# Altium project COMM_BOARD_V1.PrjPcb (part 1 of 2)
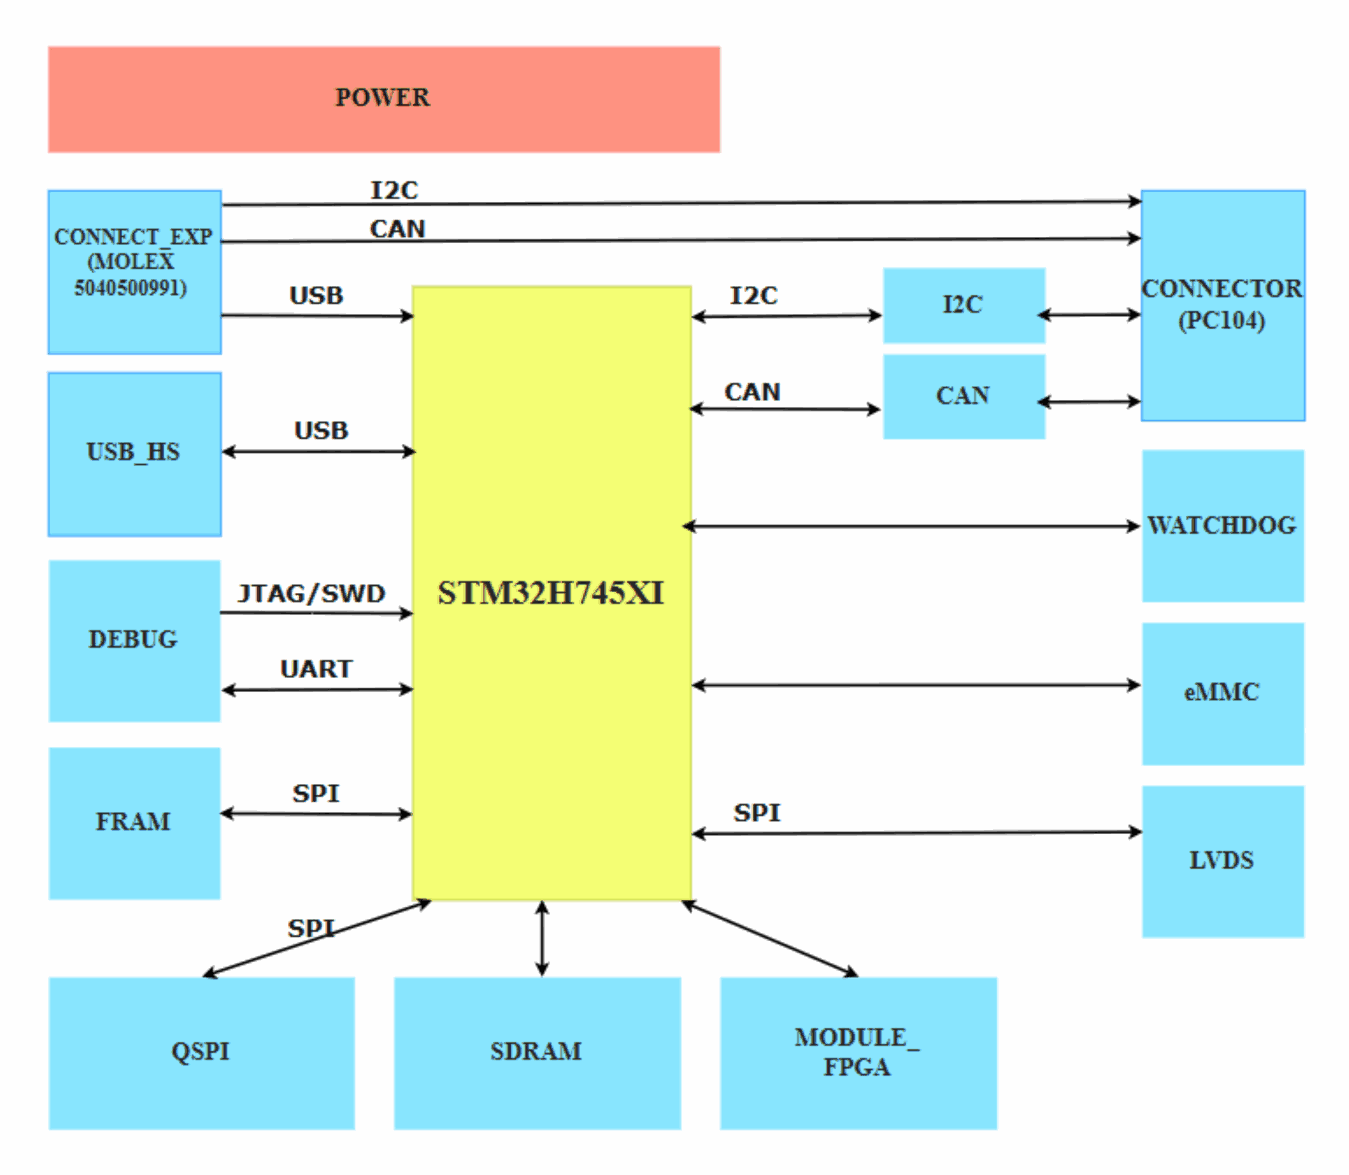
[diagram p0: BLOCK_DIAGRAM.SchDoc]
Board_Assembly_Revision: 04; Board_Document_Date: 27-Sep-2024; Board_Name: STM32H7xxx-Disco; Board_PCB_Revision: B; Board_Reference: MB1381
17 sheets, 345 parts. Net scope: flat (ports and power ports of the same name join across sheets).
Board files: PCB2.PcbDoc, PCB3.PcbDoc
Sheets:
  BLOCK_DIAGRAM.SchDoc
  POWER_TREE.SchDoc
  POWER.SchDoc
  MCU.SchDoc
  SDRAM.SchDoc
  MCU_POWER.SchDoc
  eMMC.SchDoc
  CAN.SchDoc
  USB_HS_DEVICE.SchDoc
  LVDS.SchDoc
  MODULE_FPGA.SchDoc
  DEBUG.SchDoc
  I2C.SchDoc
  CONNECTOR.SchDoc
  FRAM.SchDoc
  CONNECT_EXP.SchDoc
  WATCHDOG.SchDoc

## Sheet BLOCK_DIAGRAM.SchDoc
size 420 x 297 mm

### Notes on the sheet
- Sub-system:
- Design by:
- Sheet title:
- Project:
- Sheet:
- of
- Checked by:
- Approved by:
- Doc no:
- Revision:
- Size:
- Date:

## Sheet POWER_TREE.SchDoc
size 420 x 297 mm

### Notes on the sheet
- Sub-system:
- Design by:
- Sheet title:
- Project:
- Sheet:
- of
- Checked by:
- Approved by:
- Doc no:
- Revision:
- Size:
- Date:
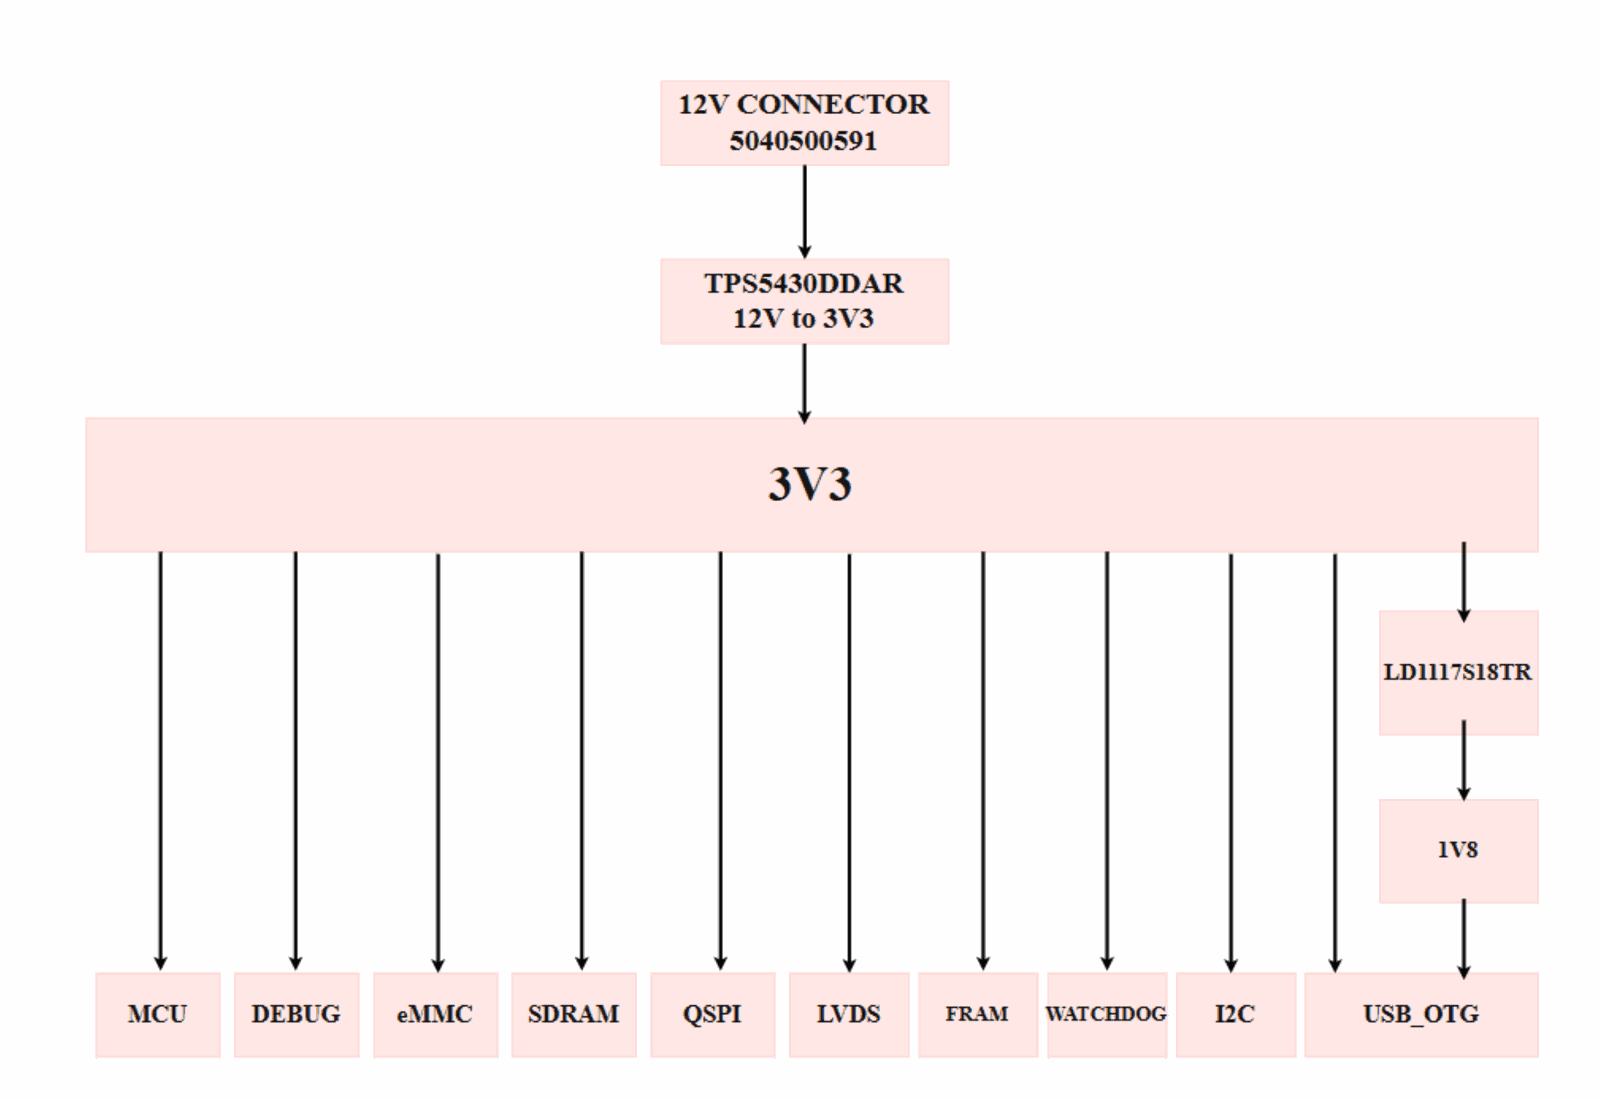
[diagram p1: POWER_TREE.SchDoc]

## Sheet POWER.SchDoc
size 420 x 297 mm; SheetNumber: 7; SheetTotal: 8
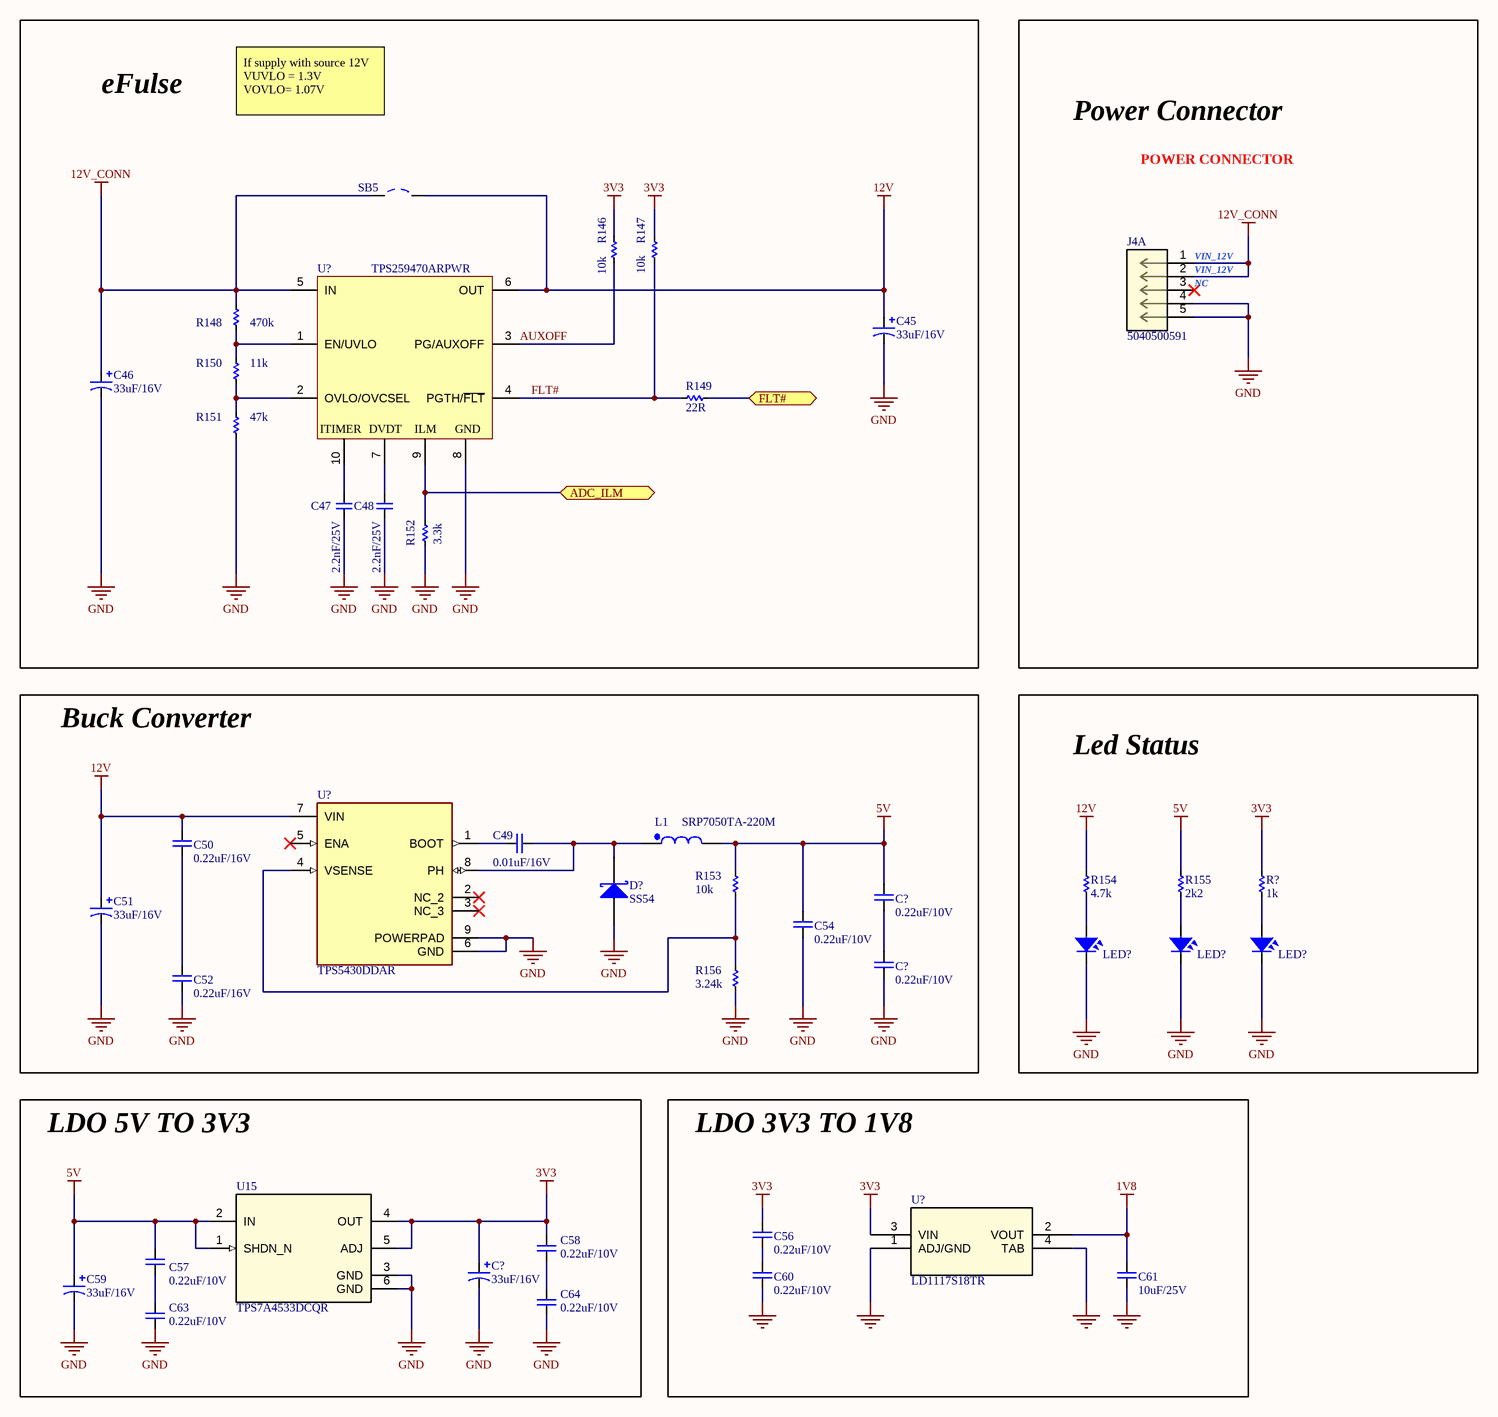
[diagram p2: POWER.SchDoc]

### Parts
(Parts that share a designator on the sheet are numbered #1, #2 ... from top to bottom, then left to right.)
C45  33uF/16V  [CAP_MP_1608X90]
C46  33uF/16V  [CAP_MP_1608X90]
C47  2.2nF/25V  [CAP_C_1608X80]
C48  2.2nF/25V  [CAP_C_1608X80]
C49  0.01uF/16V  [CAP_C_1608X80]
C50  0.22uF/16V  [CAP_C_1608X80_L]
C51  33uF/16V  [CAP_MP_1608X90]
C52  0.22uF/16V  [CAP_C_1608X80_L]
C54  0.22uF/10V  [CAP_C_1608X80]
C56  0.22uF/10V  [CAP_C_1608X80]
C57  0.22uF/10V  [CAP_C_1608X80]
C58  0.22uF/10V  [CAP_C_1608X80]
C59  33uF/16V  [CAP_MP_1608X90]
C60  0.22uF/10V  [CAP_C_1608X80]
C61  10uF/25V  [CAP_C_1608X80_L]
C63  0.22uF/10V  [CAP_C_1608X80]
C64  0.22uF/10V  [CAP_C_1608X80]
C?#1  0.22uF/10V  [CAP_C_1608X80]
C?#2  0.22uF/10V  [CAP_C_1608X80]
C?#3  33uF/16V  [CAP_MP_1608X90]
D?  SS54  [DO-214AC_SMA]
J4  5040500591  [CONN_5040500591_MOL]  (part A of 2)
L1  SRP7050TA-220M  [SRP7050TA-220M]
LED?#1  LED  [LED_0603]  (value not drawn)
LED?#2  LED  [LED_0603]  (value not drawn)
LED?#3  LED  [LED_0603]  (value not drawn)
R146  10k  [RES_C_1608X60]
R147  10k  [RES_C_1608X60]
R148  470k  [RES_C_1608X60]
R149  22R  [RES_C_1608X60]
R150  11k  [RES_C_1608X60]
R151  47k  [RES_C_1608X60]
R152  3.3k  [RES_C_1608X60]
R153  10k  [RES_C_1608X60]
R154  4.7k  [RES_C_1608X60]
R155  2k2  [RES_C_1608X60]
R156  3.24k  [RES_C_1608X60]
R?#1  1k  [RES_C_1608X60]
SB5  Solder Bridge OFF  [Jump2]  (value not drawn)
U15  TPS7A4533DCQR  [DCQ0006A-MFG]
U?#1  TPS259470ARPWR  [VQFN-HR-10]
U?#2  TPS5430DDAR  [CONV_TPS5430DDAR]
U?#3  LD1117S18TR  [SOT-223_STM]

### Blocks framed on the sheet
eFulse: C45-C48 R146-R152 SB5 U?#1
Power Connector: J4
Buck Converter: C49-C52 C54 C?#1 C?#2 D? L1 R153 R156 U?#2
Led Status: LED?#1-LED?#3 R154 R155 R?#1
LDO 5V TO 3V3: C57-C59 C63 C64 C?#3 U15
LDO 3V3 TO 1V8: C56 C60 C61 U?#3

### Ports
ADC_ILM (bidir), FLT# (bidir)

### Nets
1V8: C61.2 U?#3.2(VOUT)
3V3: C56.2 C58.2 C?#3.1 R146.2 R147.2 R?#1.2 U15.4(OUT) U15.5(ADJ) U?#3.3(VIN)
5V: C54.2 C57.2 C59.1 C?#1.2 L1.2 R153.1 R155.2 U15.1(SHDN_N) U15.2(IN)
12V: C45.1 C50.2 C51.1 R154.2 SB5.2 U?#1.6(OUT) U?#2.7(VIN)
12V_CONN: C46.1 J4.1 J4.2 R148.1 SB5.1 U?#1.5(IN)
GND: C45.2 C46.2 C47.1 C48.1 C51.2 C52.1 C54.1 C59.2 C60.1 C61.1 C63.1 C64.1 C?#2.1 C?#3.2 D?.1(A) J4.4 J4.5 LED?#1.2 LED?#2.2 LED?#3.2 R151.2 R152.2 R156.2 U15.3(GND) U15.6(GND) U?#1.8(GND) U?#2.6(GND) U?#2.9(POWERPAD) U?#3.1(ADJ/GND) U?#3.4(TAB)
AUXOFF: R146.1 U?#1.3(PG/AUXOFF)
FLT#: R147.1 R149.1 U?#1.4(PGTH/~{FLT})
NetC47_2: C47.2 U?#1.10(ITIMER)
NetC48_2: C48.2 U?#1.7(DVDT)
NetC49_1: C49.1 D?.2(K) L1.1 U?#2.8(PH)
NetC49_2: C49.2 U?#2.1(BOOT)
NetC50_1: C50.1 C52.2
NetC56_1: C56.1 C60.2
NetC57_1: C57.1 C63.2
NetC58_1: C58.1 C64.2
NetC?#1_1: C?#1.1 C?#2.2
NetLED?#1_1: LED?#1.1 R154.1
NetLED?#2_1: LED?#2.1 R155.1
NetLED?#3_1: LED?#3.1 R?#1.1
NetR107_1: R152.1 U?#1.9(ILM) ; port ADC_ILM
NetR148_2: R148.2 R150.1 U?#1.1(EN/UVLO)
NetR149_2: R149.2 ; port FLT#
NetR150_2: R150.2 R151.1 U?#1.2(OVLO/OVCSEL)
NetR153_2: R153.2 R156.1 U?#2.4(VSENSE)

Not connected (* = marked no-connect by the designer): J4 3*; U?#2 2(NC_2)* 3(NC_3)* 5(ENA)*

### Notes on the sheet
- If supply with source 12V
  VUVLO = 1.3V
  VOVLO= 1.07V
- POWER CONNECTOR
- (near J4) VIN_12V
- (near J4) NC
- Sub-system:
- Design by:
- Sheet title:
- Project:
- Sheet:
- of
- Checked by:
- Approved by:
- Doc no:
- Revision:
- Size:
- Date:
- (in symbol 5040500591) TAB

### Library data of the parts
C45 C46 C51 C59 C?#3 = _CAP_Pola_2: CAP Polarization
C47 C48 = _CAP_C_2: CAP CHIP
C49 C50 C52 C54 C56-C58 C60 C61 C63 C64 C?#1 C?#2 = CAP_SMD: CAP_Chip; Value: 33pF
D? = SS54: DIODE SCHOTTKY 40V 5A SMA; MPN: SS34; Solder: SMT; Value: SS34; MFR: *
J4 = 5040500591: 1.50mm Pitch, Pico-Lock PCB Header, Single Row, Right-Angle, Surface Mount, Gold (Au) Plating, Positive Lock, 5 Circuits, Tape and Reel; Manufacturer_Name: Molex Connector Corporation; Copyright: Copyright (C) 2025 Ultra Librarian. All rights reserved.; Manufacturer_Part_Number: 5040500591; RefDes: RefDes; Type: Type
L1 = _IND: FIXED IND 22UH 2.5A 170 MOHM SMD
LED?#1-LED?#3 = LED SMD: Value: LED 3 - 5 ly 2 Colour
R146-R153 R156 = _RES_B_2: RES
R154 = _RES_B_2: RES, 470R. 0603
R155 R?#1 = _RES_B_2: RES, 47R. 0603
SB5 = SB_OFF: Fitted: NO; Ordered by: Subcon; Revision: July-2002: Re-released for DXP Platform.; ECCN_US/EU: n/a
U15 = TPS7A4533DCQR: 1.5-A, 20-V, ultra-low-dropout voltage regulator with reverse current protection & enable 6-SOT-223 -40 to 125; Manufacturer_Name: Texas Instruments; TYPE: TYPE; RefDes: RefDes; Copyright: Copyright (C) 2025 Ultra Librarian. All rights reserved.; Manufacturer_Part_Number: TPS7A4533DCQR; Datasheet: https://www.ti.com/lit/gpn/tps7a45
U?#2 = TPS5430DDAR: 5.5V to 36V Input, 3A, 500kHz Step-Down Converter; MF: Texas Instruments; Package: HSOIC-8 Texas Instruments; Check_prices: https://www.snapeda.com/parts/TPS5430DDAR/Texas+Instruments/view-part/?ref=eda; Value: *; Purchase-URL: https://pricing.snapeda.com/search/part/TPS5430DDAR/?ref=eda; Availability: In Stock; SnapEDA_Link: https://www.snapeda.com/parts/TPS5430DDAR/Texas+Instruments/view-part/?ref=snap; MP: TPS5430DDAR; Price: None
U?#3 = LD1117S18TR: Adjustable and fixed low drop positive voltage regulator; Manufacturer_Name: STMicroelectronics; Copyright: Copyright (C) 2025 Ultra Librarian. All rights reserved.; Manufacturer_Part_Number: LD1117S18TR; Datasheet: https://www.st.com/resource/en/datasheet/ld1117.pdf; RefDes: RefDes; Type: Type

## Sheet MCU.SchDoc: STM32 microcontroller IOs
size 420 x 297 mm; CompanyName: STMicroelectronics; Organization: Microcontrollers Division; DocumentNumber: 4; SheetNumber: 3; SheetTotal: 19
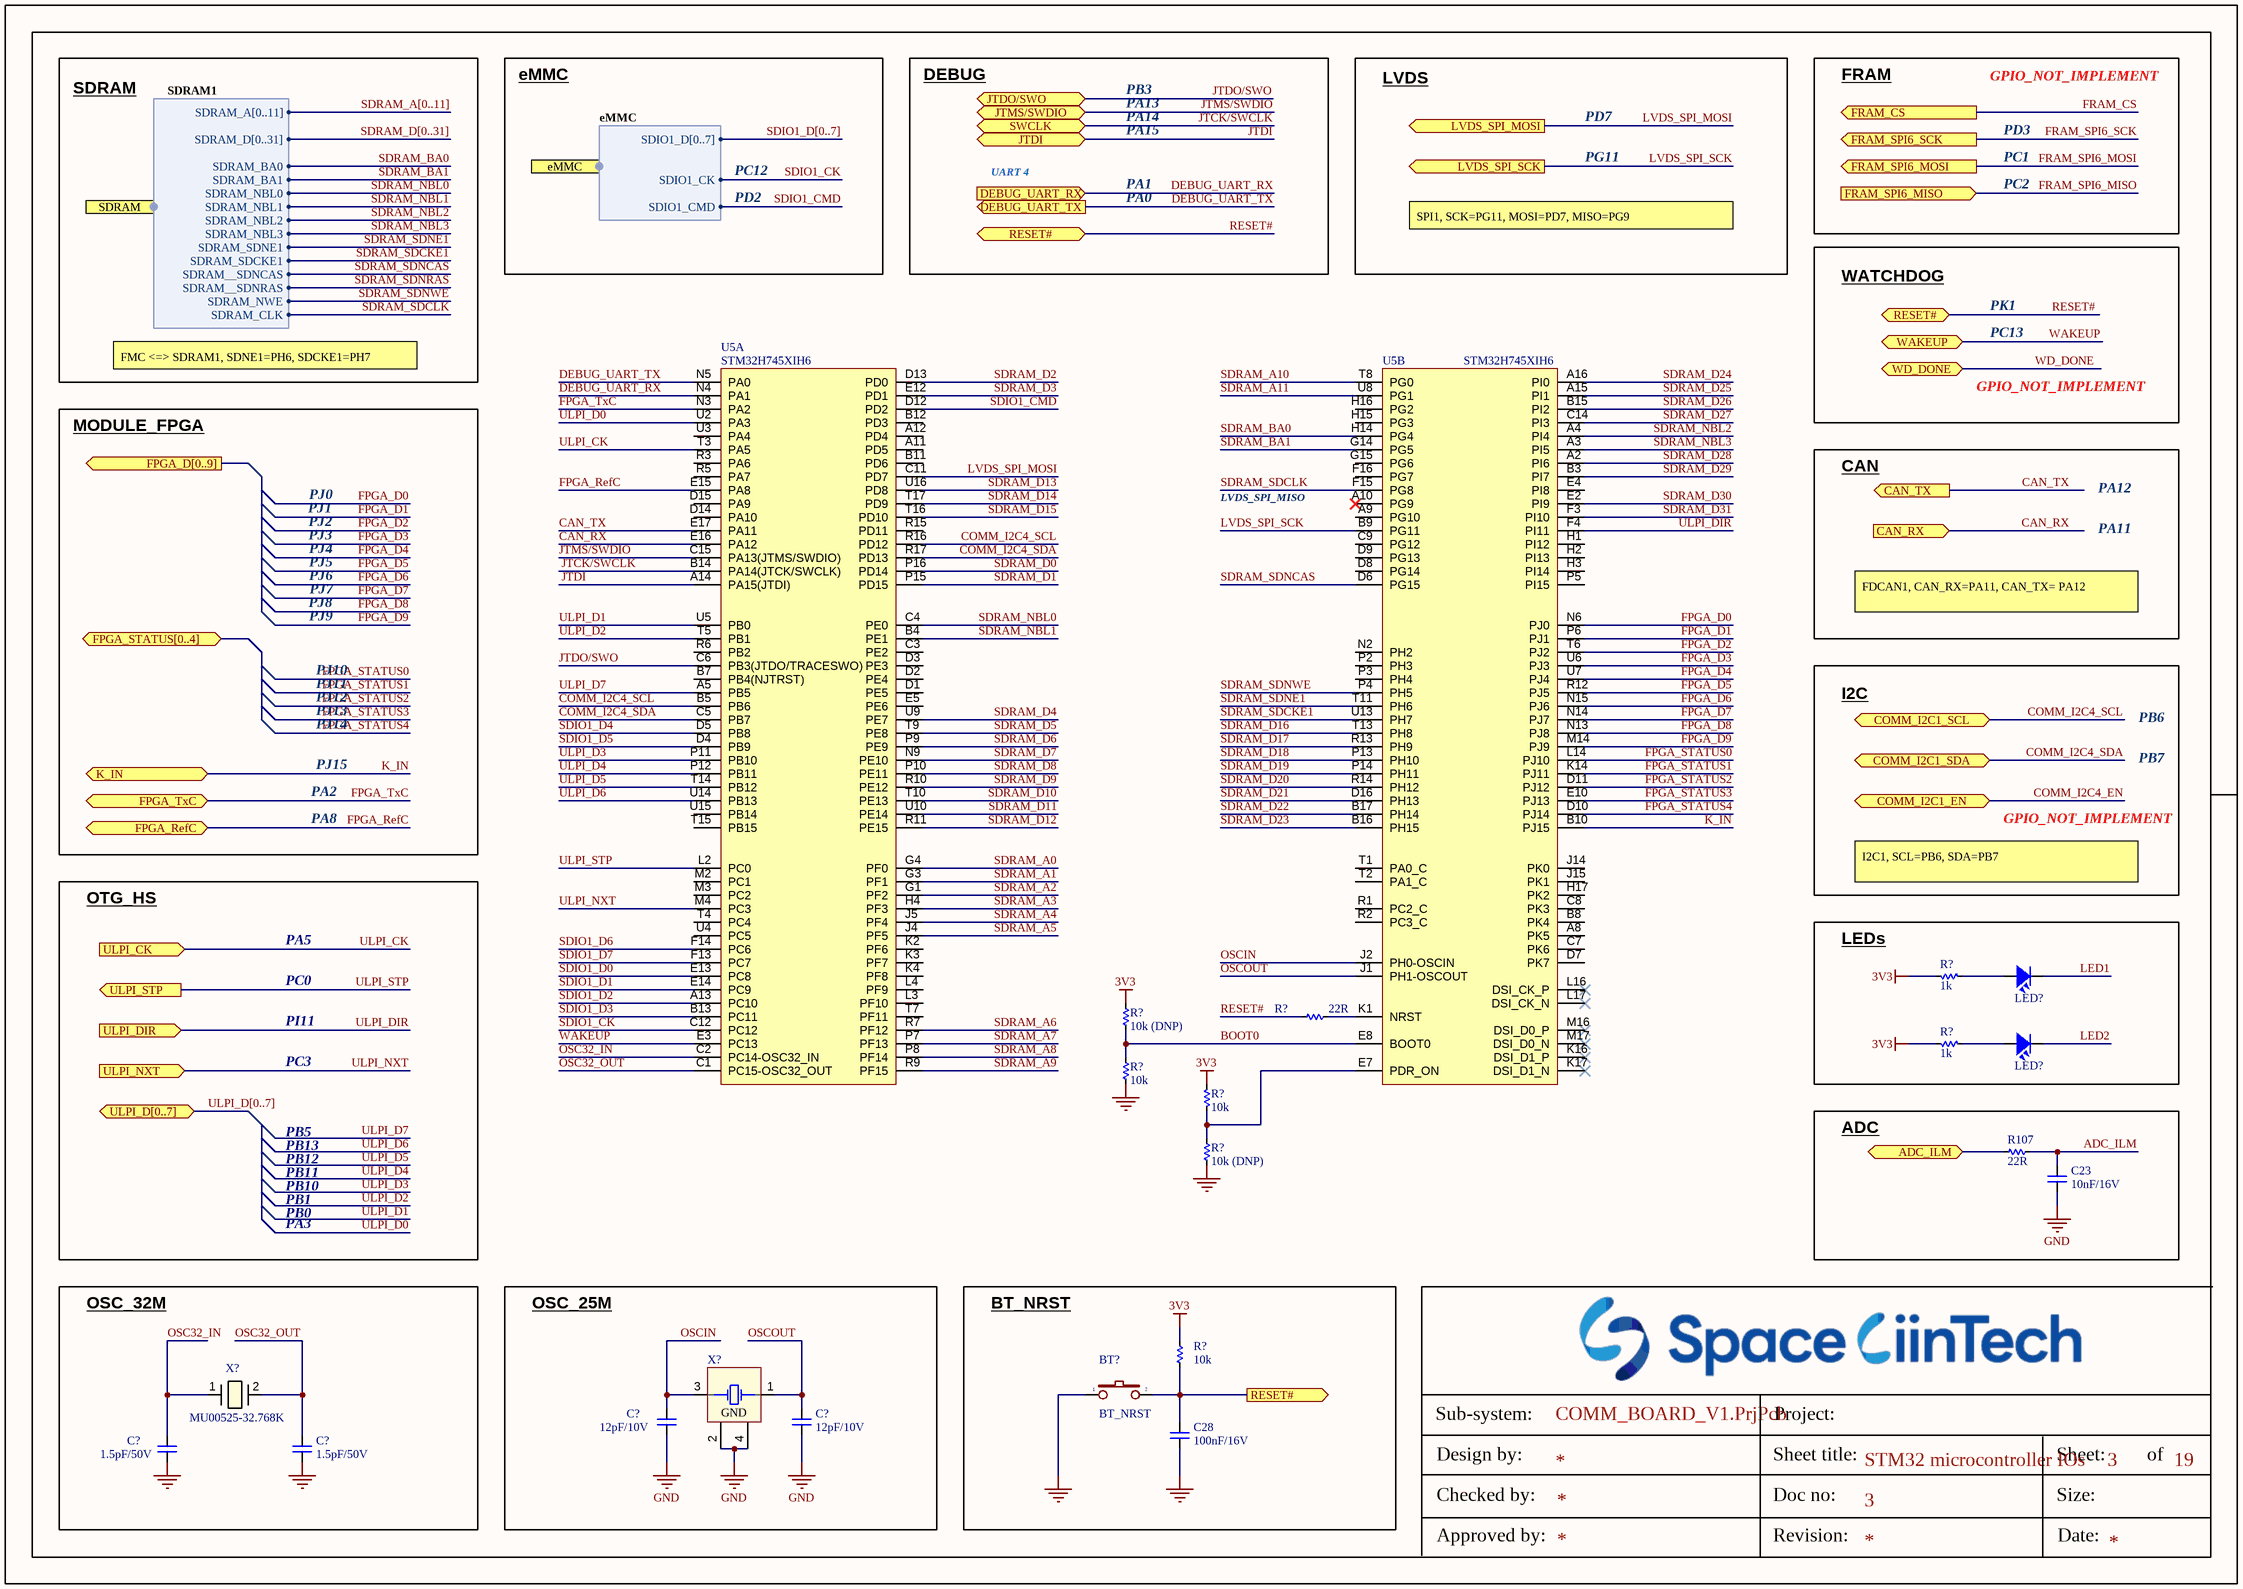
[diagram p3: MCU.SchDoc]

### Parts
(Parts that share a designator on the sheet are numbered #1, #2 ... from top to bottom, then left to right.)
BT?  BT_NRST  [SW2-SMD]
C23  10nF/16V  [CAP_C_1608X80]
C28  100nF/16V  [CAP_C_1608X80]
C?#4  12pF/10V  [CAP_C_1608X80]
C?#5  12pF/10V  [CAP_C_1608X80]
C?#6  1.5pF/50V  [CAP_C_1608X80]
C?#7  1.5pF/50V  [CAP_C_1608X80]
LED?#4  LED  [LED_0603]  (value not drawn)
LED?#5  LED  [LED_0603]  (value not drawn)
R107  22R  [RES_C_1608X60]
R?#2  1k  [RES_C_1608X60]
R?#3  10k (DNP)  [RES_C_1608X60]
R?#4  22R  [RES_C_1608X60]
R?#5  1k  [RES_C_1608X60]
R?#6  10k  [RES_C_1608X60]
R?#7  10k  [RES_C_1608X60]
R?#8  10k (DNP)  [RES_C_1608X60]
R?#9  10k  [RES_C_1608X60]
U5  value STM32H745XIH6  [TFBGA240+25]  (parts A,B of 3)
X?#1  MU00525-32.768K  [XTAL_MU00525_NDK]
X?#2  XT4  [XTAL_ECS-250-12-33Q-JES-TR]  (value not drawn)

### Blocks framed on the sheet
LEDs: LED?#4 LED?#5 R?#2 R?#5
ADC: C23 R107
OSC_32M: C?#6 C?#7 X?#1
OSC_25M: C?#4 C?#5 X?#2
BT_NRST: BT? C28 R?#9

### Ports
ADC_ILM (bidir), CAN_RX (in), CAN_TX (out), COMM_I2C1_EN (bidir), COMM_I2C1_SCL (bidir), COMM_I2C1_SDA (bidir), DEBUG_UART_RX (in), DEBUG_UART_TX (out), eMMC (harness eMMC), FPGA_D[0..9] (out), FPGA_RefC (bidir), FPGA_STATUS[0..4] (bidir), FPGA_TxC (bidir), FRAM_CS (out), FRAM_SPI6_MISO (in), FRAM_SPI6_MOSI (out), FRAM_SPI6_SCK (out), JTDI (bidir), JTDO/SWO (bidir), JTMS/SWDIO (bidir), K_IN (bidir), LVDS_SPI_MOSI (out), LVDS_SPI_SCK (out), RESET# (bidir), RESET# (out), SDRAM (harness SDRAM1), SWCLK (bidir), ULPI_CK (in), ULPI_D[0..7] (bidir), ULPI_DIR (in), ULPI_NXT (in), ULPI_STP (out), WAKEUP (bidir), WD_DONE (bidir)

### Harnesses
SDRAM1: SDRAM_A[0..11], SDRAM__SDNCAS, SDRAM_NBL0, SDRAM_SDNE1, SDRAM_SDCKE1, SDRAM_D[0..31], SDRAM_NBL1, SDRAM_BA0, SDRAM_BA1, SDRAM_NWE, SDRAM_CLK, SDRAM__SDNRAS, SDRAM_NBL3, SDRAM_NBL2
eMMC: SDIO1_D[0..7], SDIO1_CMD, SDIO1_CK

### Nets
3V3: R?#2.2 R?#3.1 R?#5.2 R?#7.1 R?#9.1
GND: BT?.1 C23.1 C28.1 C?#4.1 C?#5.1 C?#6.1 C?#7.1 R?#6.2 R?#8.2 X?#2.2(GND) X?#2.4(GND)
ADC_ILM: C23.2 R107.2
BOOT0: R?#3.2 R?#6.1 U5.E8(BOOT0)
CAN_RX: U5.E16(PA12) ; port CAN_RX
CAN_TX: U5.E17(PA11) ; port CAN_TX
COMM_I2C4_SCL: U5.B5(PB6) U5.R16(PD12) ; port COMM_I2C1_SCL
COMM_I2C4_SDA: U5.C5(PB7) U5.R17(PD13) ; port COMM_I2C1_SDA
DEBUG_UART_RX: U5.N4(PA1) ; port DEBUG_UART_RX
DEBUG_UART_TX: U5.N5(PA0) ; port DEBUG_UART_TX
FPGA_D0: U5.N6(PJ0)
FPGA_D1: U5.P6(PJ1)
FPGA_D2: U5.T6(PJ2)
FPGA_D3: U5.U6(PJ3)
FPGA_D4: U5.U7(PJ4)
FPGA_D5: U5.R12(PJ5)
FPGA_D6: U5.N15(PJ6)
FPGA_D7: U5.N14(PJ7)
FPGA_D8: U5.N13(PJ8)
FPGA_D9: U5.M14(PJ9)
FPGA_RefC: U5.E15(PA8) ; port FPGA_RefC
FPGA_STATUS0: U5.L14(PJ10)
FPGA_STATUS1: U5.K14(PJ11)
FPGA_STATUS2: U5.D11(PJ12)
FPGA_STATUS3: U5.E10(PJ13)
FPGA_STATUS4: U5.D10(PJ14)
FPGA_TxC: U5.N3(PA2) ; port FPGA_TxC
JTCK/SWCLK: U5.B14(PA14(JTCK/SWCLK)) ; port SWCLK
JTDI: U5.A14(PA15(JTDI)) ; port JTDI
JTDO/SWO: U5.C6(PB3(JTDO/TRACESWO)) ; port JTDO/SWO
JTMS/SWDIO: U5.C15(PA13(JTMS/SWDIO)) ; port JTMS/SWDIO
K_IN: U5.B10(PJ15) ; port K_IN
LED1: LED?#4.2
LED2: LED?#5.2
LVDS_SPI_MOSI: U5.C11(PD7) ; port LVDS_SPI_MOSI
LVDS_SPI_SCK: U5.B9(PG11) ; port LVDS_SPI_SCK
OSC32_IN: C?#6.2 U5.C2(PC14-OSC32_IN) X?#1.1
OSC32_OUT: C?#7.2 U5.C1(PC15-OSC32_OUT) X?#1.2
OSCIN: C?#4.2 U5.J2(PH0-OSCIN) X?#2.3(XTAL)
OSCOUT: C?#5.2 U5.J1(PH1-OSCOUT) X?#2.1(XTAL)
RESET#: BT?.2 C28.2 R?#4.1 R?#9.2 ; port RESET#
SDIO1_CK: U5.C12(PC12) ; port eMMC.SDIO1_CK
SDIO1_CMD: U5.D12(PD2) ; port eMMC.SDIO1_CMD
SDIO1_D0: U5.E13(PC8)
SDIO1_D1: U5.E14(PC9)
SDIO1_D2: U5.A13(PC10)
SDIO1_D3: U5.B13(PC11)
SDIO1_D4: U5.D5(PB8)
SDIO1_D5: U5.D4(PB9)
SDIO1_D6: U5.F14(PC6)
SDIO1_D7: U5.F13(PC7)
SDRAM_A0: U5.G4(PF0)
SDRAM_A1: U5.G3(PF1)
SDRAM_A2: U5.G1(PF2)
SDRAM_A3: U5.H4(PF3)
SDRAM_A4: U5.J5(PF4)
SDRAM_A5: U5.J4(PF5)
SDRAM_A6: U5.R7(PF12)
SDRAM_A7: U5.P7(PF13)
SDRAM_A8: U5.P8(PF14)
SDRAM_A9: U5.R9(PF15)
SDRAM_A10: U5.T8(PG0)
SDRAM_A11: U5.U8(PG1)
SDRAM_BA0: U5.H14(PG4) ; port SDRAM.SDRAM_BA0
SDRAM_BA1: U5.G14(PG5) ; port SDRAM.SDRAM_BA1
SDRAM_D0: U5.P16(PD14)
SDRAM_D1: U5.P15(PD15)
SDRAM_D2: U5.D13(PD0)
SDRAM_D3: U5.E12(PD1)
SDRAM_D4: U5.U9(PE7)
SDRAM_D5: U5.T9(PE8)
SDRAM_D6: U5.P9(PE9)
SDRAM_D7: U5.N9(PE10)
SDRAM_D8: U5.P10(PE11)
SDRAM_D9: U5.R10(PE12)
SDRAM_D10: U5.T10(PE13)
SDRAM_D11: U5.U10(PE14)
SDRAM_D12: U5.R11(PE15)
SDRAM_D13: U5.U16(PD8)
SDRAM_D14: U5.T17(PD9)
SDRAM_D15: U5.T16(PD10)
SDRAM_D16: U5.T13(PH8)
SDRAM_D17: U5.R13(PH9)
SDRAM_D18: U5.P13(PH10)
SDRAM_D19: U5.P14(PH11)
SDRAM_D20: U5.R14(PH12)
SDRAM_D21: U5.D16(PH13)
SDRAM_D22: U5.B17(PH14)
SDRAM_D23: U5.B16(PH15)
SDRAM_D24: U5.A16(PI0)
SDRAM_D25: U5.A15(PI1)
SDRAM_D26: U5.B15(PI2)
SDRAM_D27: U5.C14(PI3)
SDRAM_D28: U5.A2(PI6)
SDRAM_D29: U5.B3(PI7)
SDRAM_D30: U5.E2(PI9)
SDRAM_D31: U5.F3(PI10)
SDRAM_NBL0: U5.C4(PE0) ; port SDRAM.SDRAM_NBL0
SDRAM_NBL1: U5.B4(PE1) ; port SDRAM.SDRAM_NBL1
SDRAM_NBL2: U5.A4(PI4) ; port SDRAM.SDRAM_NBL2
SDRAM_NBL3: U5.A3(PI5) ; port SDRAM.SDRAM_NBL3
SDRAM_SDCKE1: U5.U13(PH7) ; port SDRAM.SDRAM_SDCKE1
SDRAM_SDCLK: U5.F15(PG8) ; port SDRAM.SDRAM_CLK
SDRAM_SDNCAS: U5.D6(PG15) ; port SDRAM.SDRAM__SDNCAS
SDRAM_SDNE1: U5.T11(PH6) ; port SDRAM.SDRAM_SDNE1
SDRAM_SDNWE: U5.P4(PH5) ; port SDRAM.SDRAM_NWE
ULPI_CK: U5.T3(PA5) ; port ULPI_CK
ULPI_D0: U5.U2(PA3)
ULPI_D1: U5.U5(PB0)
ULPI_D2: U5.T5(PB1)
ULPI_D3: U5.P11(PB10)
ULPI_D4: U5.P12(PB11)
ULPI_D5: U5.T14(PB12)
ULPI_D6: U5.U14(PB13)
ULPI_D7: U5.A5(PB5)
ULPI_DIR: U5.F4(PI11) ; port ULPI_DIR
ULPI_NXT: U5.M4(PC3) ; port ULPI_NXT
ULPI_STP: U5.L2(PC0) ; port ULPI_STP
WAKEUP: U5.E3(PC13) ; port WAKEUP
NetLED?#4_1: LED?#4.1 R?#2.1
NetLED?#5_1: LED?#5.1 R?#5.1
NetR107_1: R107.1 ; port ADC_ILM
NetR?#4_2: R?#4.2 U5.K1(NRST)
NetR?#7_2: R?#7.2 R?#8.1 U5.E7(PDR_ON)

Not connected (* = marked no-connect by the designer): U5 A8(PK5) A9(PG10) A10(PG9)* A11(PD5) A12(PD4) B7(PB4(NJTRST)) B8(PK4) B11(PD6) B12(PD3) C3(PE2) C7(PK6) C8(PK3) C9(PG12) D1(PE5) D2(PE4) D3(PE3) D7(PK7) D8(PG14) D9(PG13) D14(PA10) D15(PA9) E4(PI8) E5(PE6) F16(PG7) G15(PG6) H1(PI12) H2(PI13) H3(PI14) H15(PG3) H16(PG2) H17(PK2) J14(PK0) J15(PK1) K2(PF6) K3(PF7) K4(PF8) K16(DSI_D1_P)* K17(DSI_D1_N)* L3(PF10) L4(PF9) L16(DSI_CK_P)* L17(DSI_CK_N)* M2(PC1) M3(PC2) M16(DSI_D0_P)* M17(DSI_D0_N)* N2(PH2) P2(PH3) P3(PH4) P5(PI15) R1(PC2_C) R2(PC3_C) R3(PA6) R5(PA7) R6(PB2) R15(PD11) T1(PA0_C) T2(PA1_C) T4(PC4) T7(PF11) T15(PB15) U3(PA4) U4(PC5) U15(PB14)

### Buses and harness runs
bus SDIO1_D[0..7]
bus SDRAM_A[0..11]
bus SDRAM_D[0..31]
bus ULPI_D[0..7] = port ULPI_D[0..7]

### Notes on the sheet
- SDRAM
- eMMC
- DEBUG
- PB3
- PA13
- PA14
- LVDS
- PD7
- FRAM
- GPIO_NOT_IMPLEMENT
- PC12
- UART 4
- PA15
- PA1
- PG11
- PC1
- PC2
- PD3
- PD2
- PA0
- SPI1, SCK=PG11, MOSI=PD7, MISO=PG9
- WATCHDOG
- PK1
- FMC <=> SDRAM1, SDNE1=PH6, SDCKE1=PH7
- PC13
- MODULE_FPGA
- PJ1
- PJ2
- PJ0
- LVDS_SPI_MISO
- CAN
- PA12
- PA11
- PJ3
- PJ4
- PJ5
- PJ6
- PJ7
- PJ8
- PJ9
- FDCAN1, CAN_RX=PA11, CAN_TX= PA12
- PJ10
- PJ11
- PJ12
- PJ13
- PJ14
- I2C
- PB6
- PA2
- PJ15
- PB7
- PA8
- OTG_HS
- I2C1, SCL=PB6, SDA=PB7
- PA5
- PC0
- PI11
- PC3
- PB5
- PB1
- PB10
- PB11
- PB12
- PB13
- PA3
- PB0
- Sub-system:
- Design by:
- Sheet title:
- Project:
- Sheet:
- of
- Checked by:
- Approved by:
- Doc no:
- Revision:
- Size:
- Date:

### Library data of the parts
BT? = BT2: Switch button 2 pin; Value: SW chip 2 pin
C23 C28 C?#4-C?#7 = CAP_SMD: CAP_Chip; Value: 33pF
LED?#4 LED?#5 = LED SMD: Value: LED 3 - 5 ly 2 Colour
R107 R?#3 R?#4 R?#6-R?#9 = _RES_B_2: RES
R?#2 = _RES_B_2: RES, 470R. 0603
R?#5 = _RES_B_2: RES, 47R. 0603
U5 = MCD-01085: 32bit MCU TFBGA240+25; Part_Type: IC; Manufacturer: STMICROELECTRONICS; BMS_Part_Number: 9175307; Manufacturer_HQ_COO: EU; Part_Preference: Recommended; Provided_By: STM; Initial_Board_Reference: MB1381; Component_Country_Of_Origin: Philippines; ID: 3408; ShowFields: YES; Internal_Part_Number: MCD-01085; Status: Checked; Manufacturer_Part_Number: STM32H745XIH6; Package: TFBGA-265; ComponentLink1Description: Datasheet; ComponentLink1URL: http://tunmcdsvn.tun.st.com/Component_Documentation_Library/Trunk/IC/STMICROELECTRONICS_STM32H745x; Order_Code_Digikey: 497-19502-ND; Order_Code_Farnell: 3365366; Order_Code_RS: N/A
X?#1 = MU00525-32.768K: 32.768 kHz ±20ppm Crystal 12.5pF 70 kOhms 2-SMD, No Lead; Manufacturer_Name: NDK; Type: Crystals; Copyright: Copyright (C) 2025 Ultra Librarian. All rights reserved.; Manufacturer_Part_Number: MU00525-32.768K
X?#2 = XT4: Crystal, 16 MHz, -30 to 85 degC, 3.2 x 2.5 x 0.9 mm SMD; Value: 4Mhz

## Sheet SDRAM.SchDoc: SDRAM
size 420 x 297 mm; CompanyName: STMicroelectronics; Organization: Microcontrollers Division; DocumentNumber: 14; SheetNumber: 9; SheetTotal: 19
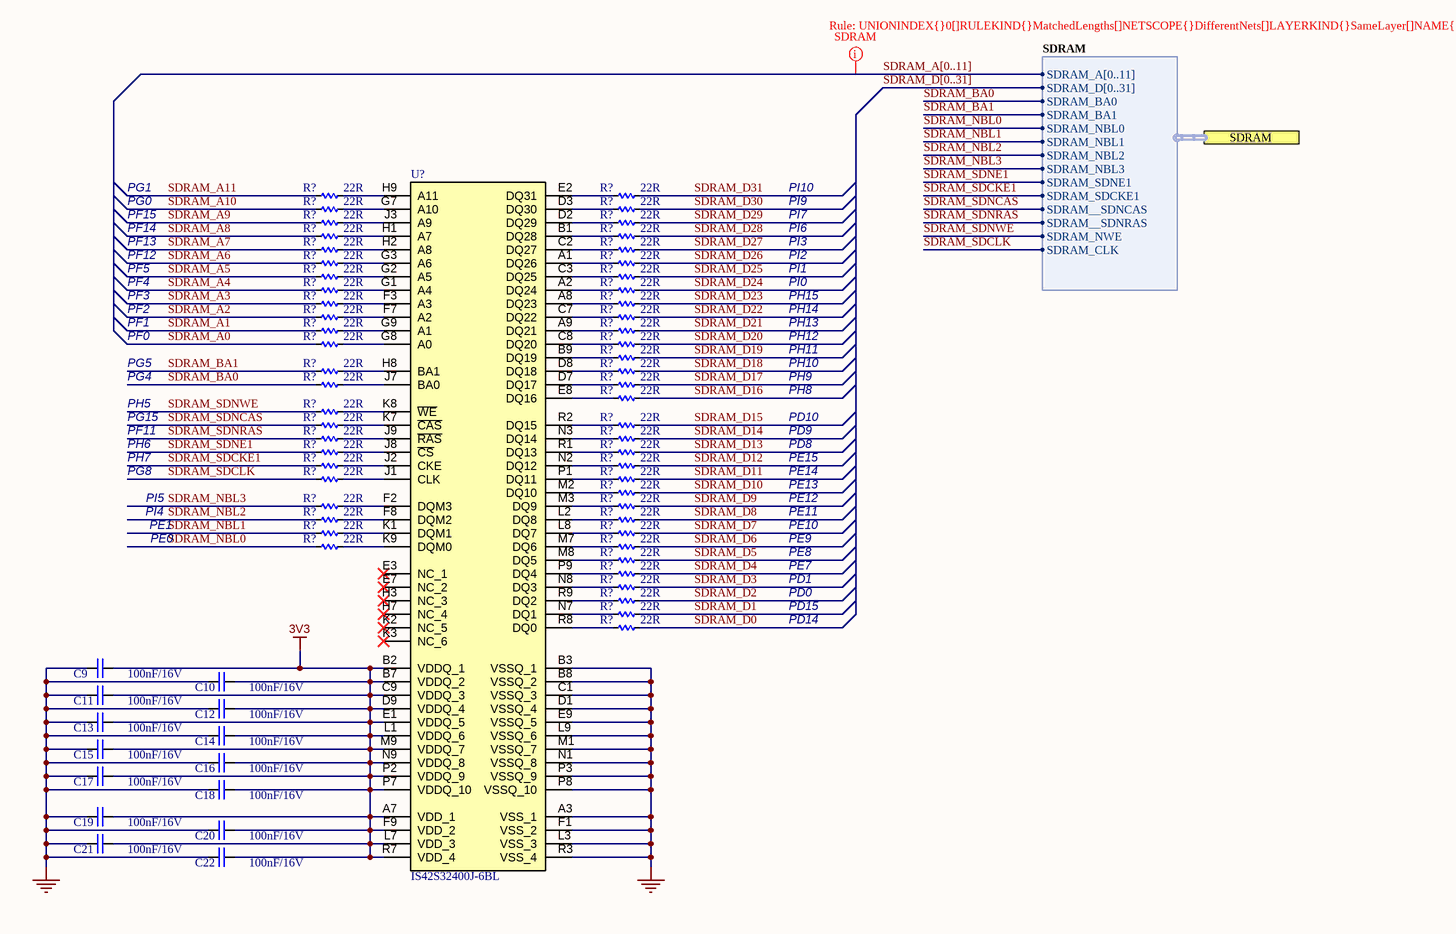
[diagram p4: SDRAM.SchDoc]

### Parts
(Parts that share a designator on the sheet are numbered #1, #2 ... from top to bottom, then left to right.)
C9  100nF/16V  [CAP_C_1608X80]
C10  100nF/16V  [CAP_C_1608X80]
C11  100nF/16V  [CAP_C_1608X80]
C12  100nF/16V  [CAP_C_1608X80]
C13  100nF/16V  [CAP_C_1608X80]
C14  100nF/16V  [CAP_C_1608X80]
C15  100nF/16V  [CAP_C_1608X80]
C16  100nF/16V  [CAP_C_1608X80]
C17  100nF/16V  [CAP_C_1608X80]
C18  100nF/16V  [CAP_C_1608X80]
C19  100nF/16V  [CAP_C_1608X80]
C20  100nF/16V  [CAP_C_1608X80]
C21  100nF/16V  [CAP_C_1608X80]
C22  100nF/16V  [CAP_C_1608X80]
R?#10  22R  [RES_C_1608X60]
R?#11  22R  [RES_C_1608X60]
R?#12  22R  [RES_C_1608X60]
R?#13  22R  [RES_C_1608X60]
R?#14  22R  [RES_C_1608X60]
R?#15  22R  [RES_C_1608X60]
R?#16  22R  [RES_C_1608X60]
R?#17  22R  [RES_C_1608X60]
R?#18  22R  [RES_C_1608X60]
R?#19  22R  [RES_C_1608X60]
R?#20  22R  [RES_C_1608X60]
R?#21  22R  [RES_C_1608X60]
R?#22  22R  [RES_C_1608X60]
R?#23  22R  [RES_C_1608X60]
R?#24  22R  [RES_C_1608X60]
R?#25  22R  [RES_C_1608X60]
R?#26  22R  [RES_C_1608X60]
R?#27  22R  [RES_C_1608X60]
R?#28  22R  [RES_C_1608X60]
R?#29  22R  [RES_C_1608X60]
R?#30  22R  [RES_C_1608X60]
R?#31  22R  [RES_C_1608X60]
R?#32  22R  [RES_C_1608X60]
R?#33  22R  [RES_C_1608X60]
R?#34  22R  [RES_C_1608X60]
R?#35  22R  [RES_C_1608X60]
R?#36  22R  [RES_C_1608X60]
R?#37  22R  [RES_C_1608X60]
R?#38  22R  [RES_C_1608X60]
R?#39  22R  [RES_C_1608X60]
R?#40  22R  [RES_C_1608X60]
R?#41  22R  [RES_C_1608X60]
R?#42  22R  [RES_C_1608X60]
R?#43  22R  [RES_C_1608X60]
R?#44  22R  [RES_C_1608X60]
R?#45  22R  [RES_C_1608X60]
R?#46  22R  [RES_C_1608X60]
R?#47  22R  [RES_C_1608X60]
R?#48  22R  [RES_C_1608X60]
R?#49  22R  [RES_C_1608X60]
R?#50  22R  [RES_C_1608X60]
R?#51  22R  [RES_C_1608X60]
R?#52  22R  [RES_C_1608X60]
R?#53  22R  [RES_C_1608X60]
R?#54  22R  [RES_C_1608X60]
R?#55  22R  [RES_C_1608X60]
R?#56  22R  [RES_C_1608X60]
R?#57  22R  [RES_C_1608X60]
R?#58  22R  [RES_C_1608X60]
R?#59  22R  [RES_C_1608X60]
R?#60  22R  [RES_C_1608X60]
R?#61  22R  [RES_C_1608X60]
R?#62  22R  [RES_C_1608X60]
R?#63  22R  [RES_C_1608X60]
R?#64  22R  [RES_C_1608X60]
R?#65  22R  [RES_C_1608X60]
U?#4  IS42S32400J-6BL  [BGA90C80P9X15_800X1300X120]

### Ports
SDRAM (harness SDRAM)

### Harnesses
SDRAM: SDRAM_A[0..11], SDRAM__SDNCAS, SDRAM_NBL0, SDRAM_SDNE1, SDRAM_SDCKE1, SDRAM_D[0..31], SDRAM_NBL1, SDRAM_BA0, SDRAM_BA1, SDRAM_NWE, SDRAM_CLK, SDRAM__SDNRAS, SDRAM_NBL3, SDRAM_NBL2

### Nets
3V3: C9.2 C10.2 C11.2 C12.2 C13.2 C14.2 C15.2 C16.2 C17.2 C18.2 C19.2 C20.2 C21.2 C22.2 U?#4.A7(VDD_1) U?#4.B2(VDDQ_1) U?#4.B7(VDDQ_2) U?#4.C9(VDDQ_3) U?#4.D9(VDDQ_4) U?#4.E1(VDDQ_5) U?#4.F9(VDD_2) U?#4.L1(VDDQ_6) U?#4.L7(VDD_3) U?#4.M9(VDDQ_7) U?#4.N9(VDDQ_8) U?#4.P2(VDDQ_9) U?#4.P7(VDDQ_10) U?#4.R7(VDD_4)
GND: C9.1 C10.1 C11.1 C12.1 C13.1 C14.1 C15.1 C16.1 C17.1 C18.1 C19.1 C20.1 C21.1 C22.1 U?#4.A3(VSS_1) U?#4.B3(VSSQ_1) U?#4.B8(VSSQ_2) U?#4.C1(VSSQ_3) U?#4.D1(VSSQ_4) U?#4.E9(VSSQ_5) U?#4.F1(VSS_2) U?#4.L3(VSS_3) U?#4.L9(VSSQ_6) U?#4.M1(VSSQ_7) U?#4.N1(VSSQ_8) U?#4.P3(VSSQ_9) U?#4.P8(VSSQ_10) U?#4.R3(VSS_4)
SDRAM_A0: R?#32.1
SDRAM_A1: R?#30.1
SDRAM_A2: R?#28.1
SDRAM_A3: R?#26.1
SDRAM_A4: R?#24.1
SDRAM_A5: R?#22.1
SDRAM_A6: R?#20.1
SDRAM_A7: R?#18.1
SDRAM_A8: R?#16.1
SDRAM_A9: R?#14.1
SDRAM_A10: R?#12.1
SDRAM_A11: R?#10.1
SDRAM_BA0: R?#37.1 ; port SDRAM.SDRAM_BA0
SDRAM_BA1: R?#35.1 ; port SDRAM.SDRAM_BA1
SDRAM_D0: R?#65.2
SDRAM_D1: R?#64.2
SDRAM_D2: R?#63.2
SDRAM_D3: R?#62.2
SDRAM_D4: R?#61.2
SDRAM_D5: R?#60.2
SDRAM_D6: R?#59.2
SDRAM_D7: R?#57.2
SDRAM_D8: R?#55.2
SDRAM_D9: R?#53.2
SDRAM_D10: R?#51.2
SDRAM_D11: R?#50.2
SDRAM_D12: R?#48.2
SDRAM_D13: R?#46.2
SDRAM_D14: R?#44.2
SDRAM_D15: R?#42.2
SDRAM_D16: R?#39.2
SDRAM_D17: R?#38.2
SDRAM_D18: R?#36.2
SDRAM_D19: R?#34.2
SDRAM_D20: R?#33.2
SDRAM_D21: R?#31.2
SDRAM_D22: R?#29.2
SDRAM_D23: R?#27.2
SDRAM_D24: R?#25.2
SDRAM_D25: R?#23.2
SDRAM_D26: R?#21.2
SDRAM_D27: R?#19.2
SDRAM_D28: R?#17.2
SDRAM_D29: R?#15.2
SDRAM_D30: R?#13.2
SDRAM_D31: R?#11.2
SDRAM_NBL0: R?#58.1 ; port SDRAM.SDRAM_NBL0
SDRAM_NBL1: R?#56.1 ; port SDRAM.SDRAM_NBL1
SDRAM_NBL2: R?#54.1 ; port SDRAM.SDRAM_NBL2
SDRAM_NBL3: R?#52.1 ; port SDRAM.SDRAM_NBL3
SDRAM_SDCKE1: R?#47.1 ; port SDRAM.SDRAM_SDCKE1
SDRAM_SDCLK: R?#49.1 ; port SDRAM.SDRAM_CLK
SDRAM_SDNCAS: R?#41.1 ; port SDRAM.SDRAM__SDNCAS
SDRAM_SDNE1: R?#45.1 ; port SDRAM.SDRAM_SDNE1
SDRAM_SDNRAS: R?#43.1 ; port SDRAM.SDRAM__SDNRAS
SDRAM_SDNWE: R?#40.1 ; port SDRAM.SDRAM_NWE
NetR?#10_2: R?#10.2 U?#4.H9(A11)
NetR?#11_1: R?#11.1 U?#4.E2(DQ31)
NetR?#12_2: R?#12.2 U?#4.G7(A10)
NetR?#13_1: R?#13.1 U?#4.D3(DQ30)
NetR?#14_2: R?#14.2 U?#4.J3(A9)
NetR?#15_1: R?#15.1 U?#4.D2(DQ29)
NetR?#16_2: R?#16.2 U?#4.H1(A7)
NetR?#17_1: R?#17.1 U?#4.B1(DQ28)
NetR?#18_2: R?#18.2 U?#4.H2(A8)
NetR?#19_1: R?#19.1 U?#4.C2(DQ27)
NetR?#20_2: R?#20.2 U?#4.G3(A6)
NetR?#21_1: R?#21.1 U?#4.A1(DQ26)
NetR?#22_2: R?#22.2 U?#4.G2(A5)
NetR?#23_1: R?#23.1 U?#4.C3(DQ25)
NetR?#24_2: R?#24.2 U?#4.G1(A4)
NetR?#25_1: R?#25.1 U?#4.A2(DQ24)
NetR?#26_2: R?#26.2 U?#4.F3(A3)
NetR?#27_1: R?#27.1 U?#4.A8(DQ23)
NetR?#28_2: R?#28.2 U?#4.F7(A2)
NetR?#29_1: R?#29.1 U?#4.C7(DQ22)
NetR?#30_2: R?#30.2 U?#4.G9(A1)
NetR?#31_1: R?#31.1 U?#4.A9(DQ21)
NetR?#32_2: R?#32.2 U?#4.G8(A0)
NetR?#33_1: R?#33.1 U?#4.C8(DQ20)
NetR?#34_1: R?#34.1 U?#4.B9(DQ19)
NetR?#35_2: R?#35.2 U?#4.H8(BA1)
NetR?#36_1: R?#36.1 U?#4.D8(DQ18)
NetR?#37_2: R?#37.2 U?#4.J7(BA0)
NetR?#38_1: R?#38.1 U?#4.D7(DQ17)
NetR?#39_1: R?#39.1 U?#4.E8(DQ16)
NetR?#40_2: R?#40.2 U?#4.K8(~{WE})
NetR?#41_2: R?#41.2 U?#4.K7(~{CAS})
NetR?#42_1: R?#42.1 U?#4.R2(DQ15)
NetR?#43_2: R?#43.2 U?#4.J9(~{RAS})
NetR?#44_1: R?#44.1 U?#4.N3(DQ14)
NetR?#45_2: R?#45.2 U?#4.J8(~{CS})
NetR?#46_1: R?#46.1 U?#4.R1(DQ13)
NetR?#47_2: R?#47.2 U?#4.J2(CKE)
NetR?#48_1: R?#48.1 U?#4.N2(DQ12)
NetR?#49_2: R?#49.2 U?#4.J1(CLK)
NetR?#50_1: R?#50.1 U?#4.P1(DQ11)
NetR?#51_1: R?#51.1 U?#4.M2(DQ10)
NetR?#52_2: R?#52.2 U?#4.F2(DQM3)
NetR?#53_1: R?#53.1 U?#4.M3(DQ9)
NetR?#54_2: R?#54.2 U?#4.F8(DQM2)
NetR?#55_1: R?#55.1 U?#4.L2(DQ8)
NetR?#56_2: R?#56.2 U?#4.K1(DQM1)
NetR?#57_1: R?#57.1 U?#4.L8(DQ7)
NetR?#58_2: R?#58.2 U?#4.K9(DQM0)
NetR?#59_1: R?#59.1 U?#4.M7(DQ6)
NetR?#60_1: R?#60.1 U?#4.M8(DQ5)
NetR?#61_1: R?#61.1 U?#4.P9(DQ4)
NetR?#62_1: R?#62.1 U?#4.N8(DQ3)
NetR?#63_1: R?#63.1 U?#4.R9(DQ2)
NetR?#64_1: R?#64.1 U?#4.N7(DQ1)
NetR?#65_1: R?#65.1 U?#4.R8(DQ0)

Not connected (* = marked no-connect by the designer): U?#4 E3(NC_1)* E7(NC_2)* H3(NC_3)* H7(NC_4)* K2(NC_5)* K3(NC_6)*

### Buses and harness runs
bus SDRAM_A[0..11]
bus SDRAM_D[0..31]

### Layout directives
rule Matched Net Lengths [Tolerance = 100mil]: (no net found under the mark)

### Notes on the sheet
- PF14
- PF15
- PG0
- PG1
- PI10
- PI9
- PI7
- PI6
- PF3
- PF4
- PF5
- PF12
- PF13
- PI3
- PI2
- PI1
- PI0
- PH15
- PF0
- PF1
- PF2
- PG5
- PH14
- PH13
- PH12
- PH11
- PH10
- PH5
- PF11
- PG4
- PG15
- PD9
- PD10
- PH9
- PH8
- PH6
- PH7
- PG8
- PI5
- PE12
- PE13
- PE14
- PE15
- PD8
- PI4
- PE1
- PE0
- PE7
- PE8
- PE9
- PE10
- PE11
- PD14
- PD15
- PD0
- PD1
- Sub-system:
- Design by:
- Sheet title:
- Project:
- Sheet:
- of
- Checked by:
- Approved by:
- Doc no:
- Revision:
- Size:
- Date:

### Library data of the parts
C9-C22 = CAP_SMD: CAP_Chip; Value: 33pF
R?#10-R?#65 = _RES_B_2: RES
U?#4 = IS42S32400J-6BL: DRAM 128M, 3.3V, SDRAM, 4Mx32, 166Mhz, 90 ball BGA (8mmx13mm) RoHS; Manufacturer_Name: Integrated Silicon Solution Inc.; Geometry.Height: 1.2mm; Manufacturer_Part_Number: IS42S32400J-6BL; Mouser Part Number: *; Mouser Price/Stock: *; Arrow Part Number: IS42S32400J-6BL; Arrow Price/Stock: https://www.arrow.com/en/products/is42s32400j-6bl/integrated-silicon-solution-inc?utm_currency=USD&region=nac; Datasheet Link: https://www.issi.com/WW/pdf/42-45S32400J.pdf

## Sheet MCU_POWER.SchDoc: STM32 microcontroller Power
size 420 x 297 mm; CompanyName: STMicroelectronics; Organization: Microcontrollers Division; DocumentNumber: 5; SheetNumber: 4; SheetTotal: 19
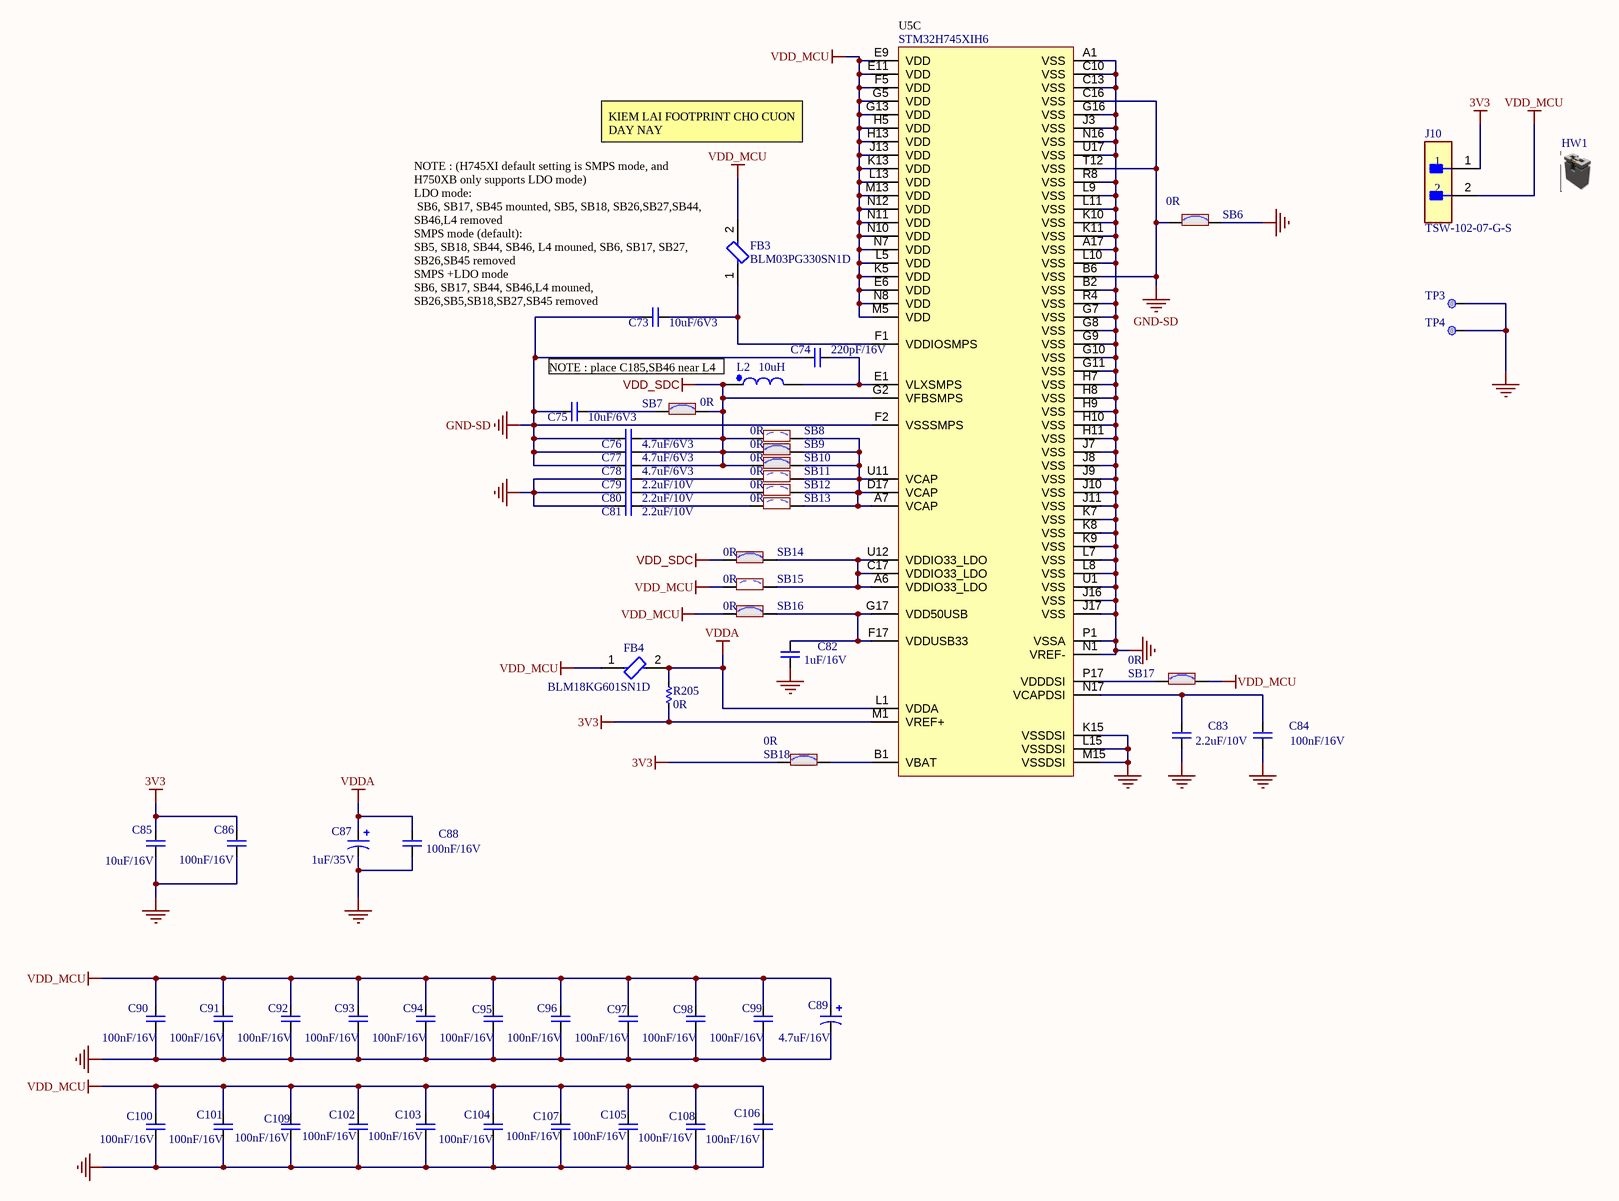
[diagram p5: MCU_POWER.SchDoc]

### Parts
C73  10uF/6V3  [CAP_C_1608X80]
C74  220pF/16V  [CAP_C_1608X80]
C75  10uF/6V3  [CAP_C_1608X80]
C76  4.7uF/6V3  [CAP_C_1608X80]
C77  4.7uF/6V3  [CAP_C_1608X80]
C78  4.7uF/6V3  [CAP_C_1608X80]
C79  2.2uF/10V  [CAP_C_1608X80]
C80  2.2uF/10V  [CAP_C_1608X80]
C81  2.2uF/10V  [CAP_C_1608X80]
C82  1uF/16V  [CAP_C_1608X80]
C83  2.2uF/10V  [CAP_C_1608X80]
C84  100nF/16V  [CAP_C_1608X80]
C85  10uF/16V  [CAP_C_1608X80]
C86  100nF/16V  [CAP_C_1608X80]
C87  1uF/35V  [CAP_MP_1608X90]
C88  100nF/16V  [CAP_C_1608X80]
C89  4.7uF/16V  [CAP_MP_1608X90]
C90  100nF/16V  [CAP_C_1608X80]
C91  100nF/16V  [CAP_C_1608X80]
C92  100nF/16V  [CAP_C_1608X80]
C93  100nF/16V  [CAP_C_1608X80]
C94  100nF/16V  [CAP_C_1608X80]
C95  100nF/16V  [CAP_C_1608X80]
C96  100nF/16V  [CAP_C_1608X80]
C97  100nF/16V  [CAP_C_1608X80]
C98  100nF/16V  [CAP_C_1608X80]
C99  100nF/16V  [CAP_C_1608X80]
C100  100nF/16V  [CAP_C_1608X80]
C101  100nF/16V  [CAP_C_1608X80]
C102  100nF/16V  [CAP_C_1608X80]
C103  100nF/16V  [CAP_C_1608X80]
C104  100nF/16V  [CAP_C_1608X80]
C105  100nF/16V  [CAP_C_1608X80]
C106  100nF/16V  [CAP_C_1608X80]
C107  100nF/16V  [CAP_C_1608X80]
C108  100nF/16V  [CAP_C_1608X80]
C109  100nF/16V  [CAP_C_1608X80]
FB3  BLM03PG330SN1D  [FP-BLM03-0_03-d0_3-IPC_C]
FB4  BLM18KG601SN1D  [FP-BLM18-0_15-t0_8-IPC_A]
HW1  Shunt 2.54mm  [N/A]  (value not drawn)  (mechanical)
J10  TSW-102-07-G-S  [FP-TSW-102-07-G-S-MFG]
L2  10uH  [INDC1608X95N]
R205  0R  [RES_C_1608X60]
SB6  value 0R  [Jump2]  (hidden comment: SB_ON)
SB7  value 0R  [Jump2]  (hidden comment: SB_ON)
SB8  value 0R  [Jump2]  (hidden comment: SB_OFF)
SB9  value 0R  [Jump2]  (hidden comment: SB_ON)
SB10  value 0R  [Jump2]  (hidden comment: SB_ON)
SB11  value 0R  [Jump2]  (hidden comment: SB_OFF)
SB12  value 0R  [Jump2]  (hidden comment: SB_OFF)
SB13  value 0R  [Jump2]  (hidden comment: SB_OFF)
SB14  value 0R  [Jump2]  (hidden comment: SB_ON)
SB15  value 0R  [Jump2]  (hidden comment: SB_OFF)
SB16  value 0R  [Jump2]  (hidden comment: SB_ON)
SB17  value 0R  [Jump2]  (hidden comment: SB_ON)
SB18  value 0R  [Jump2]  (hidden comment: SB_ON)
TP3  Test Point  [TESTPOINT]  (value not drawn)  (no BOM)
TP4  Test Point  [TESTPOINT]  (value not drawn)  (no BOM)
U5  value STM32H745XIH6  [TFBGA240+25]  (part C of 3)

### Nets
3V3: C85.2 C86.2 J10.1 R205.1 SB18.1 U5.M1(VREF+)
GND: C79.2 C80.2 C81.2 C82.1 C83.1 C84.1 C85.1 C86.1 C87.2 C88.1 C89.2 C90.1 C91.1 C92.1 C93.1 C94.1 C95.1 C96.1 C97.1 C98.1 C99.1 C100.1 C101.1 C102.1 C103.1 C104.1 C105.1 C106.1 C107.1 C108.1 C109.1 SB6.2 TP3.1 TP4.1 U5.A1(VSS) U5.A17(VSS) U5.B2(VSS) U5.C10(VSS) U5.C13(VSS) U5.G7(VSS) U5.G8(VSS) U5.G9(VSS) U5.G10(VSS) U5.G11(VSS) U5.G16(VSS) U5.H7(VSS) U5.H8(VSS) U5.H9(VSS) U5.H10(VSS) U5.H11(VSS) U5.J3(VSS) U5.J7(VSS) U5.J8(VSS) U5.J9(VSS) U5.J10(VSS) U5.J11(VSS) U5.J16(VSS) U5.J17(VSS) U5.K7(VSS) U5.K8(VSS) U5.K9(VSS) U5.K10(VSS) U5.K11(VSS) U5.K15(VSSDSI) U5.L7(VSS) U5.L8(VSS) U5.L9(VSS) U5.L10(VSS) U5.L11(VSS) U5.L15(VSSDSI) U5.M15(VSSDSI) U5.N1(VREF-) U5.N16(VSS) U5.P1(VSSA) U5.R4(VSS) U5.R8(VSS) U5.U1(VSS) U5.U17(VSS)
GND-SD: C73.2 C74.2 C75.2 C76.2 C77.2 C78.2 SB6.1 U5.B6(VSS) U5.C16(VSS) U5.F2(VSSSMPS) U5.T12(VSS)
VDD_MCU: C89.1 C90.2 C91.2 C92.2 C93.2 C94.2 C95.2 C96.2 C97.2 C98.2 C99.2 C100.2 C101.2 C102.2 C103.2 C104.2 C105.2 C106.2 C107.2 C108.2 C109.2 FB3.2 FB4.1 J10.2 SB15.1 SB16.1 SB17.2 U5.E6(VDD) U5.E9(VDD) U5.E11(VDD) U5.F5(VDD) U5.G5(VDD) U5.G13(VDD) U5.H5(VDD) U5.H13(VDD) U5.J13(VDD) U5.K5(VDD) U5.K13(VDD) U5.L5(VDD) U5.L13(VDD) U5.M5(VDD) U5.M13(VDD) U5.N7(VDD) U5.N8(VDD) U5.N10(VDD) U5.N11(VDD) U5.N12(VDD)
VDD_SDC: C76.1 C77.1 C78.1 L2.1 SB7.2 SB8.1 SB9.1 SB10.1 SB14.1 U5.G2(VFBSMPS)
VDDA: C87.1 C88.2 FB4.2 R205.2 U5.L1(VDDA)
NetC73_1: C73.1 FB3.1 U5.F1(VDDIOSMPS)
NetC74_1: C74.1 L2.2 U5.E1(VLXSMPS)
NetC75_1: C75.1 SB7.1
NetC79_1: C79.1 SB11.1
NetC80_1: C80.1 SB12.1
NetC81_1: C81.1 SB13.1
NetC82_2: C82.2 SB16.2 U5.F17(VDDUSB33) U5.G17(VDD50USB)
NetC83_2: C83.2 C84.2 U5.N17(VCAPDSI)
NetSB8_2: SB8.2 SB9.2 SB10.2 SB11.2 SB12.2 SB13.2 U5.A7(VCAP) U5.D17(VCAP) U5.U11(VCAP)
NetSB14_2: SB14.2 SB15.2 U5.A6(VDDIO33_LDO) U5.C17(VDDIO33_LDO) U5.U12(VDDIO33_LDO)
NetSB17_1: SB17.1 U5.P17(VDDDSI)
NetSB18_2: SB18.2 U5.B1(VBAT)

### Notes on the sheet
- KIEM LAI FOOTPRINT CHO CUON DAY NAY
- (near C73) NOTE : (H745XI default setting is SMPS mode, and H750XB only supports LDO mode)
  LDO mode:
  SB6, SB17, SB45 mounted, SB5, SB18, SB26,SB27,SB44, SB46,L4 removed
  SMPS mode (default):
  SB5, SB18, SB44, SB46, L4 mouned, SB6, SB17, SB27, SB26,SB45 removed
  SMPS +LDO mode
  SB6, SB17, SB44, SB46,L4 mouned, SB26,SB5,SB18,SB27,SB45 removed
- (near L2) NOTE : place C185,SB46 near L4
- Sub-system:
- Project:
- Design by:
- Sheet title:
- Sheet
- of
- Checked by:
- Approved by:
- Doc no:
- Revision
- Size:
- Date:

### Library data of the parts
C73-C86 C88 C90-C109 = CAP_SMD: CAP_Chip; Value: 33pF
C87 C89 = _CAP_Pola_2: CAP Polarization
FB3 = CMP-0686-00117-3: Ferrite Bead, 0201, 33Ω @ 100MHz, 25%, 0.09Ω, 750mA; Number of Lines: 1; Material: Steel; Impedance: 33R; DC Resistance (DCR): 90mR; Package Quantity: 1; Lead Free: Lead Free; Packaging: Tape and Reel; Case Code (Metric): 0603; Max DC Current: 750mA; Number of Pins: 2; Current Rating: 750mA; Case/Package: 0201; Termination: SMD/SMT; Tolerance: 25%; Series: BLM03P; Min Operating Temperature: -55°C; Test Frequency: 100MHz; Max Operating Temperature: 125°C; Width: 0.3mm; REACH SVHC: No SVHC; Max Current Rating: 750mA; Height: 0.3mm; Case Code (Imperial): 0201; RoHS Compliant: Yes; Length: 0.6mm; Number of Circuits: 1
FB4 = CMP-0686-00581-3: Chip Ferrite Bead, 0603, 600Ω @ 100MHz, 0.15Ω, 25%, 1.3A; Material: Steel; Number of Lines: 1; Impedance: 600R; DC Resistance (DCR): 150mR; Tolerance: 25%; Case Code (Metric): 1608; Width: 0.8mm; DC Current: 1.3A; Max DC Current: 1.3A; Package Quantity: 1; Number of Pins: 2; Military Standard: Not; RoHS Compliant: Yes; Termination: SMD/SMT; Max Operating Temperature: 125°C; Length: 1.6mm; Depth: 0.8mm; Case Code (Imperial): 0603; Series: BLM18K; Inductor Type: FERRITE BEAD; Core Material: Ferrite; Number of Circuits: 1; Height: 0.8mm; Case/Package: 0603; REACH SVHC: No SVHC; Packaging: Tape and Reel; Min Operating Temperature: -55°C; Max Current Rating: 1.3A; Radiation Hardening: No; Current Rating: 1.3A; Lead Free: Lead Free; Test Frequency: 100MHz; Weight: 7.1E-05oz
HW1 = MCD-00043: SHUNT 2.54mm BLACK; Manufacturer_Part_Number: SNT-100-BK-G; Manufacturer: SAMTEC; Full_Alternate_Internal_Part_Number: MCD-02388; Manufacturer_HQ_COO: Unknown; Part_Preference: Recommended; Part_Type: Misc; Partial_Alternate_Internal_Part_Number: MCD-01849, MCD-01864; Provided_By: Subcon; Alternate_EMS: A; Component_Country_Of_Origin: China, Costa Rica, Malaysia, USA, Vietnam; ID: 2551; Order_Code_RS: 158-7784; ShowFields: YES; Value: SNT-100-BK-G; Internal_Part_Number: MCD-00043; PartType: Mechanical; ECCN_US: n/a; ECCN_EU: n/a; ComponentLink1Description: Samtec_Shunt_Jumper_SNT100.pdf; ComponentLink1URL: http://tunmcdsvn.tun.st.com/Component_Documentation_Library/Trunk/Misc/SAMTEC_SNT-100-BK-G; Order_Code_Digikey: SAM8858-ND; Order_Code_Farnell: 2505007; Package: 2.54x5.08mm; Status: Released
J10 = CMP-02766-000084-1: CONN HEADER VERT 2POS 2.54MM; Manufacturer: Samtec; Number Of Contacts: 2; Voltage Rating: 550V; Conn Orientation: Straight; Current Rating: 6.3A; Conn Gender: Male; Package: TSW-102-07-G-S; Digikey Description: CONN HEADER VERT 2POS 2.54MM; ComponentLink2URL: http://suddendocs.samtec.com/catalog_english/tsw_th.pdf; Height: 8.71mm; Temperature: -55°C to +125°C; Device Class L2: Headers and Wire Housings; ComponentLink2Description: Datasheet; Device Class L3: unset; Contact Material: Gold,Nickel; Temperature Range Low: -55°C; Temperature Range High: +125°C; RoHS: TRUE; Device Class L1: Connectors; Mouser Description: Conn Unshrouded Header HDR 2 POS 2.54mm Solder ST Thru-Hole Automotive Bulk; Number Of Rows: 1; Category: Conn; Pitch: 2.54mm; Lead Free: Yes; Automotive: No; Manufacturer Part Number: TSW-102-07-G-S; Footprint Url: http://suddendocs.samtec.com/prints/tsw-xxx-xx-x-x-xx-xxx-footprint.pdf; Octopart: https://octopart.com/tsw-102-07-g-s-samtec-272197
L2 = _IND: FIXED IND 10UH 300MA 600MOHM SMD
R205 = _RES_B_2: RES
SB6 SB7 SB9 SB10 SB14 SB16-SB18 = MCD-00071: Solder Bridge ON; Part_Type: Resistor; Manufacturer: YAGEO; Manufacturer_HQ_COO: Unknown; Manufacturer_Part_Number: RC0603JR-070RL; Part_Preference: Recommended; Provided_By: Subcon; Initial_Board_Reference: mb1274; Component_Country_Of_Origin: China; ID: 2521; Order_Code_RS: 199-5647; ShowFields: YES; Internal_Part_Number: MCD-00071; ECCN_US: n/a; ECCN_EU: n/a; Status: Released; ComponentLink1URL: http://tunmcdsvn.tun.st.com/Component_Documentation_Library/Trunk/Resistor/YAGEO_RC_Series; Order_Code_Digikey: 311-0.0GRTR-ND; Order_Code_Farnell: 2421846; Package: 0603
SB8 SB11-SB13 SB15 = MCD-00072: Solder Bridge OFF; Part_Type: Resistor; Manufacturer: YAGEO; Manufacturer_HQ_COO: Unknown; Manufacturer_Part_Number: RC0603JR-070RL; Part_Preference: Recommended; Initial_Board_Reference: mb1274; Component_Country_Of_Origin: China; ID: 2520; Order_Code_RS: 199-5647; ShowFields: YES; Internal_Part_Number: MCD-00072; Status: Released; ECCN_US: n/a; ECCN_EU: n/a; Provided_By: n/a; ComponentLink1URL: http://tunmcdsvn.tun.st.com/Component_Documentation_Library/Trunk/Resistor/YAGEO_RC_Series; Order_Code_Digikey: 311-0.0GRTR-ND; Order_Code_Farnell: 2421846; Package: 0603
TP3 TP4 = MCD-00630: Test Point 0.3mm; Part_Type: Misc; Part_Preference: Recommended; Initial_Board_Reference: MB1264; ID: 3115; ShowFields: YES; Component_Country_Of_Origin: Unknown; Internal_Part_Number: MCD-00630; Status: Released; ECCN_US: n/a; ECCN_EU: n/a; Provided_By: n/a; Manufacturer: N/A; Manufacturer_Part_Number: N/A; Order_Code_Digikey: N/A; Order_Code_Farnell: N/A; Order_Code_RS: N/A; ComponentLink1URL: http://tunmcdsvn.tun.st.com/Component_Documentation_Library/Trunk; Manufacturer_HQ_COO: Unknown
U5 = MCD-01085: as U5 on sheet MCU; Internal_Part_Number: MCD-01085; Status: Checked; Manufacturer_Part_Number: STM32H745XIH6; Package: TFBGA-265; ComponentLink1Description: Datasheet; ComponentLink1URL: http://tunmcdsvn.tun.st.com/Component_Documentation_Library/Trunk/IC/STMICROELECTRONICS_STM32H745x; Order_Code_Digikey: 497-19502-ND; Order_Code_Farnell: 3365366; Order_Code_RS: N/A

## Sheet eMMC.SchDoc: eMMC
size 420 x 297 mm; CompanyName: STMicroelectronics; Organization: Microcontrollers Division; DocumentNumber: 1; SheetNumber: 10; SheetTotal: 19
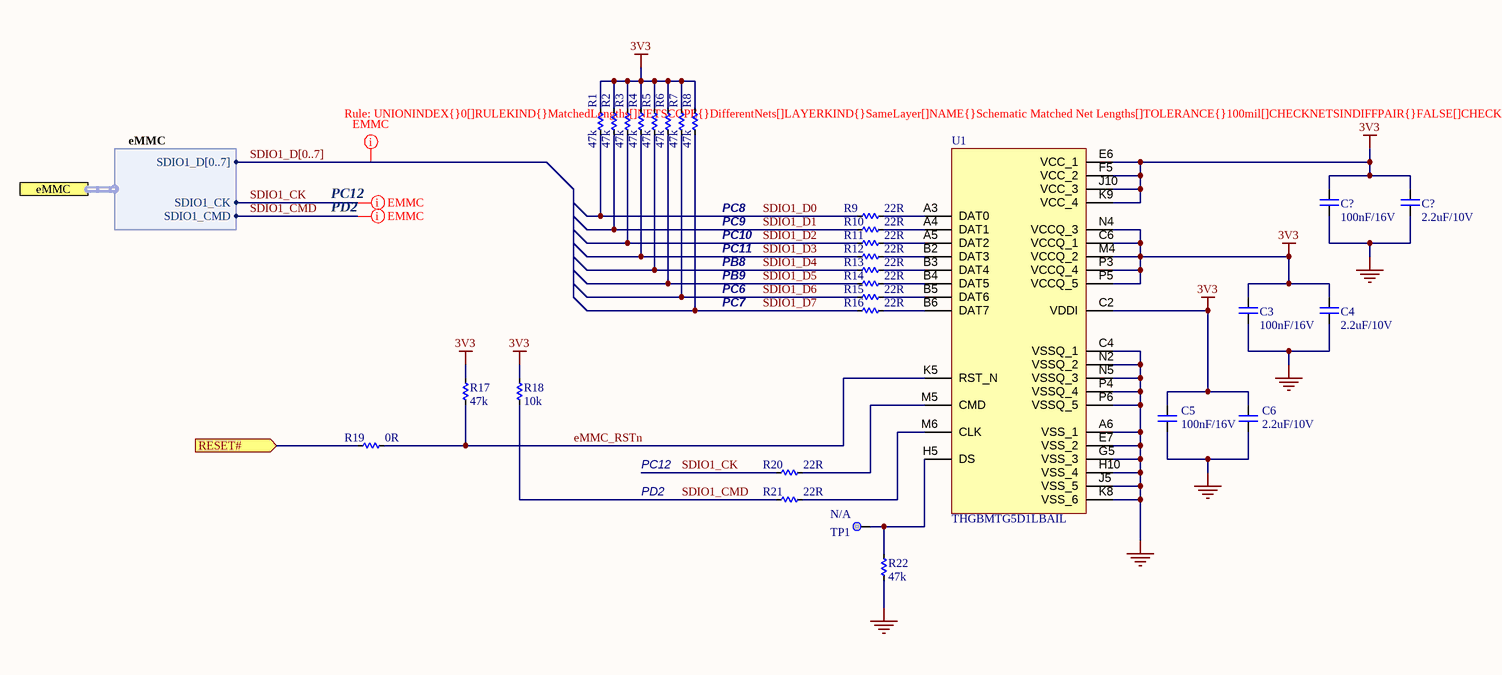
[diagram p6: eMMC.SchDoc]

### Parts
(Parts that share a designator on the sheet are numbered #1, #2 ... from top to bottom, then left to right.)
C3  100nF/16V  [CAP_C_1608X80]
C4  2.2uF/10V  [CAP_C_1608X80]
C5  100nF/16V  [CAP_C_1608X80]
C6  2.2uF/10V  [CAP_C_1608X80]
C?#8  100nF/16V  [CAP_C_1608X80]
C?#9  2.2uF/10V  [CAP_C_1608X80]
R1  47k  [RES_C_1608X60]
R2  47k  [RES_C_1608X60]
R3  47k  [RES_C_1608X60]
R4  47k  [RES_C_1608X60]
R5  47k  [RES_C_1608X60]
R6  47k  [RES_C_1608X60]
R7  47k  [RES_C_1608X60]
R8  47k  [RES_C_1608X60]
R9  22R  [RES_C_1608X60]
R10  22R  [RES_C_1608X60]
R11  22R  [RES_C_1608X60]
R12  22R  [RES_C_1608X60]
R13  22R  [RES_C_1608X60]
R14  22R  [RES_C_1608X60]
R15  22R  [RES_C_1608X60]
R16  22R  [RES_C_1608X60]
R17  47k  [RES_C_1608X60]
R18  10k  [RES_C_1608X60]
R19  0R  [RES_C_1608X60]
R20  22R  [RES_C_1608X60]
R21  22R  [RES_C_1608X60]
R22  47k  [RES_C_1608X60]
TP1  Test Point  [TESTPOINT]  (value not drawn)  (no BOM)
U1  THGBMTG5D1LBAIL  [BGA153C50P14X14_1150X1300X80]

### Ports
eMMC (harness eMMC), RESET# (in)

### Harnesses
eMMC: SDIO1_D[0..7], SDIO1_CMD, SDIO1_CK

### Nets
3V3: C3.2 C4.2 C5.2 C6.2 C?#8.2 C?#9.2 R1.2 R2.2 R3.2 R4.2 R5.2 R6.2 R7.2 R8.2 R17.2 R18.2 U1.C2(VDDI) U1.C6(VCCQ_1) U1.E6(VCC_1) U1.F5(VCC_2) U1.J10(VCC_3) U1.K9(VCC_4) U1.M4(VCCQ_2) U1.N4(VCCQ_3) U1.P3(VCCQ_4) U1.P5(VCCQ_5)
GND: C3.1 C4.1 C5.1 C6.1 C?#8.1 C?#9.1 R22.1 U1.A6(VSS_1) U1.C4(VSSQ_1) U1.E7(VSS_2) U1.G5(VSS_3) U1.H10(VSS_4) U1.J5(VSS_5) U1.K8(VSS_6) U1.N2(VSSQ_2) U1.N5(VSSQ_3) U1.P4(VSSQ_4) U1.P6(VSSQ_5)
eMMC_RSTn: R17.1 R19.1 U1.K5(RST_N)
RESET#: R19.2 ; port RESET#
SDIO1_CK: R20.1 ; port eMMC.SDIO1_CK
SDIO1_CMD: R18.1 R21.1 ; port eMMC.SDIO1_CMD
SDIO1_D0: R1.1 R9.1
SDIO1_D1: R2.1 R10.1
SDIO1_D2: R3.1 R11.1
SDIO1_D3: R4.1 R12.1
SDIO1_D4: R5.1 R13.1
SDIO1_D5: R6.1 R14.1
SDIO1_D6: R7.1 R15.1
SDIO1_D7: R8.1 R16.1
NetR9_2: R9.2 U1.A3(DAT0)
NetR10_2: R10.2 U1.A4(DAT1)
NetR11_2: R11.2 U1.A5(DAT2)
NetR12_2: R12.2 U1.B2(DAT3)
NetR13_2: R13.2 U1.B3(DAT4)
NetR14_2: R14.2 U1.B4(DAT5)
NetR15_2: R15.2 U1.B5(DAT6)
NetR16_2: R16.2 U1.B6(DAT7)
NetR20_2: R20.2 U1.M5(CMD)
NetR21_2: R21.2 U1.M6(CLK)
NetR22_2: R22.2 TP1.1 U1.H5(DS)

### Buses and harness runs
bus SDIO1_D[0..7]

### Layout directives
rule Matched Net Lengths [Tolerance = 100mil]: (no net found under the mark), SDIO1_CK, SDIO1_CMD

### Notes on the sheet
- PC12
- PD2
- PC8
- PC9
- PC10
- PC11
- PC6
- PC7
- PB8
- PB9
- Sub-system:
- Design by:
- Sheet title:
- Project:
- Sheet:
- of
- Checked by:
- Approved by:
- Doc no:
- Revision:
- Size:
- Date:

### Library data of the parts
C3-C6 C?#8 C?#9 = CAP_SMD: CAP_Chip; Value: 33pF
R1-R22 = _RES_B_2: RES
TP1 = MCD-00630: as TP3 on sheet MCU_POWER; Internal_Part_Number: MCD-00630; Status: Released; ECCN_US: n/a; ECCN_EU: n/a; Provided_By: n/a; Manufacturer: N/A; Manufacturer_Part_Number: N/A; Order_Code_Digikey: N/A; Order_Code_Farnell: N/A; Order_Code_RS: N/A; Value: N/A; ComponentLink1URL: http://tunmcdsvn.tun.st.com/Component_Documentation_Library/Trunk; Manufacturer_HQ_COO: Unknown
U1 = THGBMTG5D1LBAIL: NAND Flash Serial e-MMC 3.3V 32G-bit 32G/8G/4G x 1/4-bit/8-bit 13.7ns 153-Pin WFBGA; Manufacturer_Name: KIOXIA Corporation; Geometry.Height: 0.8mm; Manufacturer_Part_Number: THGBMTG5D1LBAIL; Mouser Part Number: 757-THGBMTG5D1LBAIL; Mouser Price/Stock: https://www.mouser.co.uk/ProductDetail/Kioxia-America/THGBMTG5D1LBAIL?qs=Znm5pLBrcAKPRFVhV%252B0AbQ%3D%3D; Arrow Part Number: THGBMTG5D1LBAIL; Arrow Price/Stock: null?region=nac; Datasheet Link: https://static6.arrow.com/aropdfconversion/5b79d7e5222d5200711a0ed1082b7aa51b6d9eb4/xia_thgbmtg5d1lbail15nm4gbe-mmcver5.0_e_rev.1.0_20211007.pdf

## Sheet CAN.SchDoc
size 420 x 297 mm; SheetNumber: 3; SheetTotal: 3
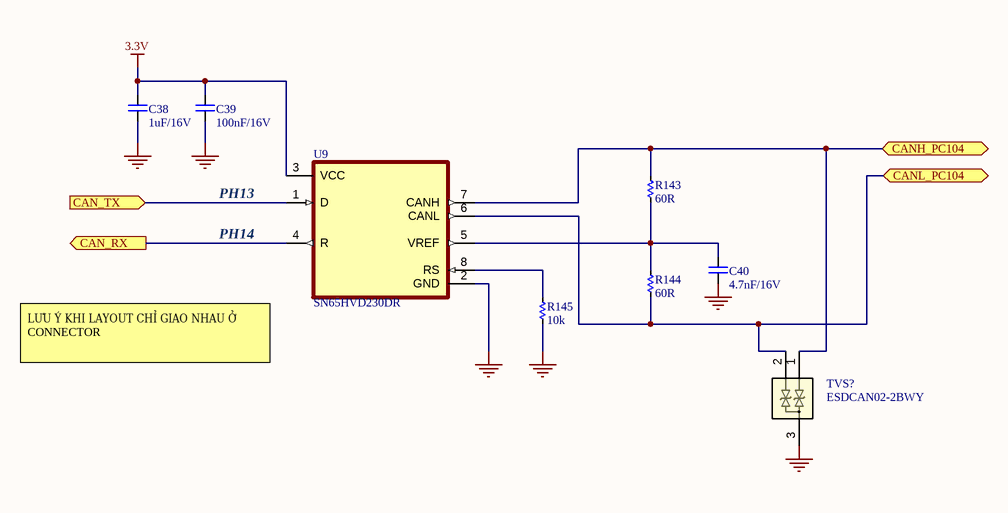
[diagram p7: CAN.SchDoc]

### Parts
C38  1uF/16V  [CAP_C_1608X80]
C39  100nF/16V  [CAP_C_1608X80]
C40  4.7nF/16V  [CAP_C_1608X80]
CR1  ESDCAN02-2BWY  [SOT323-3L_STM]
R143  60R  [RES_C_1608X60]
R144  60R  [RES_C_1608X60]
R145  10k  [RES_C_1608X60]
U9  SN65HVD230DR  [SOIC127P599X175-8N]

### Ports
CAN_RX (out), CAN_TX (in), CANH_PC104 (bidir), CANL_PC104 (bidir)

### Nets
3.3V: C38.1 C39.1 U9.3(VCC)
GND: C38.2 C39.2 C40.2 CR1.3 R145.1 U9.2(GND)
CAN_RX: U9.4(R) ; port CAN_RX
CAN_TX: U9.1(D) ; port CAN_TX
NetC40_1: C40.1 R143.1 R144.2 U9.5(VREF)
NetCR1_1: CR1.1 R143.2 U9.7(CANH) ; port CANH_PC104
NetCR1_2: CR1.2 R144.1 U9.6(CANL) ; port CANL_PC104
NetR145_2: R145.2 U9.8(RS)

### Notes on the sheet
- PH13
- PH14
- (near U9) LƯU Ý KHI LAYOUT CHỈ GIAO NHAU Ở CONNECTOR
- Sub-system:
- Design by:
- Sheet title:
- Project:
- Sheet:
- of
- Checked by:
- Approved by:
- Doc no:
- Revision:
- Size:
- Date:

### Library data of the parts
C38-C40 = CAP_SMD: CAP_Chip; Value: 33pF
CR1 = ESDCAN02-2BWY: Automotive dual-line TVS in SOT323-3L for CAN bus (12 V system); Manufacturer_Name: STMicroelectronics
R143-R145 = _RES_B_2: RES
U9 = SN65HVD230DR: 3.3 V CAN Transceiver with Standby Mode; MF: Texas Instruments; SnapEDA_Link: https://www.snapeda.com/parts/SN65HVD230DR/Texas+Instruments/view-part/?ref=snap; Package: SOIC-8 Texas Instruments; Value: *; MP: SN65HVD230DR; Check_prices: https://www.snapeda.com/parts/SN65HVD230DR/Texas+Instruments/view-part/?ref=eda

## Sheet USB_HS_DEVICE.SchDoc
size 420 x 297 mm; SheetNumber: 8; SheetTotal: 9
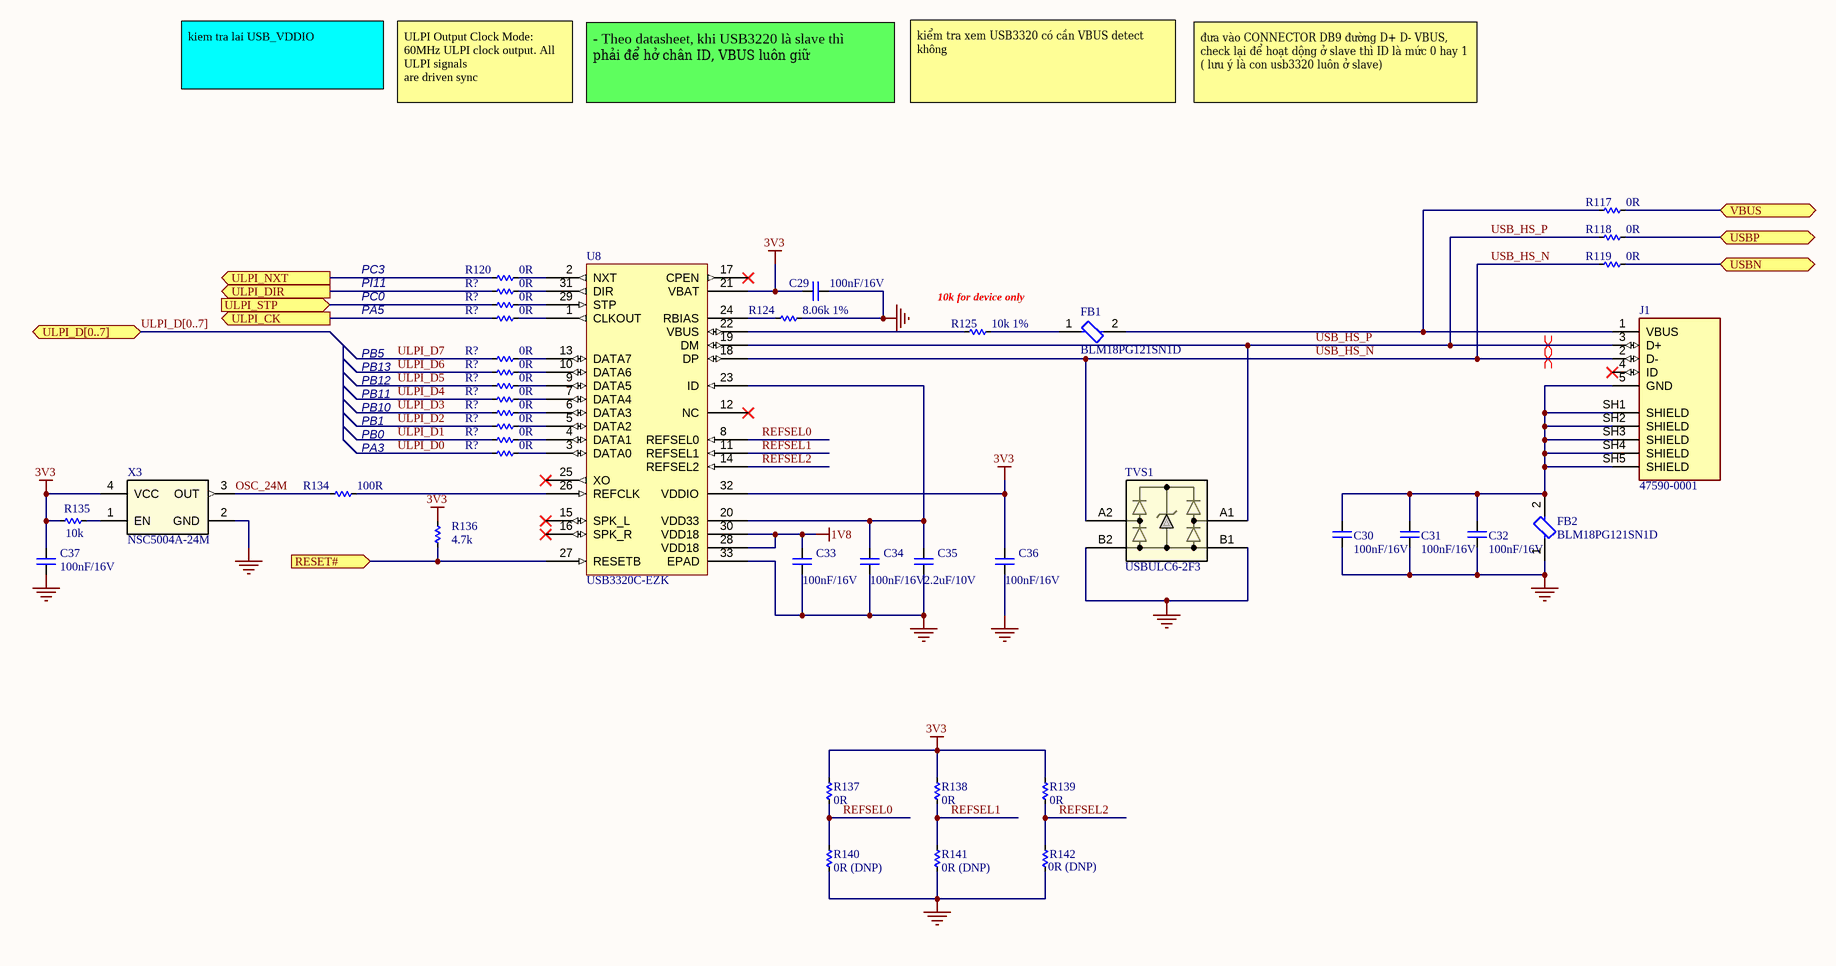
[diagram p8: USB_HS_DEVICE.SchDoc]

### Parts
(Parts that share a designator on the sheet are numbered #1, #2 ... from top to bottom, then left to right.)
C29  100nF/16V  [CAP_C_1608X80]
C30  100nF/16V  [CAP_C_1608X80]
C31  100nF/16V  [CAP_C_1608X80]
C32  100nF/16V  [CAP_C_1608X80]
C33  100nF/16V  [CAP_C_1608X80]
C34  100nF/16V  [CAP_C_1608X80]
C35  2.2uF/10V  [CAP_C_1608X80]
C36  100nF/16V  [CAP_C_1608X80]
C37  100nF/16V  [CAP_C_1608X80]
FB1  BLM18PG121SN1D  [FP-BLM18-0_15-t0_8-IPC_A]
FB2  BLM18PG121SN1D  [FP-BLM18-0_15-t0_8-IPC_A]
J1  47590-0001  [MOLEX_47590-0001]
R117  0R  [RES_C_1608X60]
R118  0R  [RES_C_1608X60]
R119  0R  [RES_C_1608X60]
R120  0R  [RES_C_1608X60]
R124  8.06k 1%  [RES_C_1608X60]
R125  10k 1%  [RES_C_1608X60]
R134  100R  [RES_C_1608X60]
R135  10k  [RES_C_1608X60]
R136  4.7k  [RES_C_1608X60]
R137  0R  [RES_C_1608X60]
R138  0R  [RES_C_1608X60]
R139  0R  [RES_C_1608X60]
R140  0R (DNP)  [RES_C_1608X60]
R141  0R (DNP)  [RES_C_1608X60]
R142  0R (DNP)  [RES_C_1608X60]
R?#66  0R  [RES_C_1608X60]
R?#67  0R  [RES_C_1608X60]
R?#68  0R  [RES_C_1608X60]
R?#69  0R  [RES_C_1608X60]
R?#70  0R  [RES_C_1608X60]
R?#71  0R  [RES_C_1608X60]
R?#72  0R  [RES_C_1608X60]
R?#73  0R  [RES_C_1608X60]
R?#74  0R  [RES_C_1608X60]
R?#75  0R  [RES_C_1608X60]
R?#76  0R  [RES_C_1608X60]
TVS1  USBULC6-2F3  [FLIPCHIP4_USBUL_STM]
U8  USB3320C-EZK  [QFN32_5X5MC_MCH]
X3  NSC5004A-24M  [NSC5004D-25M]

### Ports
RESET# (in), ULPI_CK (out), ULPI_D[0..7] (bidir), ULPI_DIR (out), ULPI_NXT (out), ULPI_STP (in), USBN (bidir), USBP (bidir), VBUS (bidir)

### Nets
1V8: C33.2 U8.28(VDD18) U8.30(VDD18)
3V3: C29.2 C36.2 C37.2 R135.2 R136.1 R137.1 R138.1 R139.1 U8.21(VBAT) U8.32(VDDIO) X3.4(VCC)
GND: C29.1 C30.1 C31.1 C32.1 C33.1 C34.1 C35.1 C36.1 C37.1 FB2.1 R124.2 R140.2 R141.2 R142.2 TVS1.B1 TVS1.B2 U8.33(EPAD) X3.2(GND)
OSC_24M: R134.2 X3.3(OUT)
REFSEL0: R137.2 R140.1 U8.8(REFSEL0)
REFSEL1: R138.2 R141.1 U8.11(REFSEL1)
REFSEL2: R139.2 R142.1 U8.14(REFSEL2)
RESET#: R136.2 U8.27(RESETB) ; port RESET#
ULPI_CK: R?#68.2 ; port ULPI_CK
ULPI_D0: R?#76.2
ULPI_D1: R?#75.2
ULPI_D2: R?#74.2
ULPI_D3: R?#73.2
ULPI_D4: R?#72.2
ULPI_D5: R?#71.2
ULPI_D6: R?#70.2
ULPI_D7: R?#69.2
ULPI_DIR: R?#66.2 ; port ULPI_DIR
ULPI_NXT: R120.2 ; port ULPI_NXT
ULPI_STP: R?#67.2 ; port ULPI_STP
USB_CON_N: R119.2 ; port USBN
USB_CON_P: R118.2 ; port USBP
USB_HS_N: J1.2(D-) R119.1 TVS1.A2 U8.18(DP)
USB_HS_P: J1.3(D+) R118.1 TVS1.A1 U8.19(DM)
NetC30_2: C30.2 C31.2 C32.2 FB2.2 J1.5(GND) J1.SH1(SHIELD) J1.SH2(SHIELD) J1.SH3(SHIELD) J1.SH4(SHIELD) J1.SH5(SHIELD)
NetC34_2: C34.2 C35.2 U8.20(VDD33) U8.23(ID)
NetFB1_1: FB1.1 R125.2
NetFB1_2: FB1.2 J1.1(VBUS) R117.1
NetJ9_9: R117.2 ; port VBUS
NetR120_1: R120.1 U8.2(NXT)
NetR124_1: R124.1 U8.24(RBIAS)
NetR125_1: R125.1 U8.22(VBUS)
NetR134_1: R134.1 U8.26(REFCLK)
NetR135_1: R135.1 X3.1(EN)
NetR?#66_1: R?#66.1 U8.31(DIR)
NetR?#67_1: R?#67.1 U8.29(STP)
NetR?#68_1: R?#68.1 U8.1(CLKOUT)
NetR?#69_1: R?#69.1 U8.13(DATA7)
NetR?#70_1: R?#70.1 U8.10(DATA6)
NetR?#71_1: R?#71.1 U8.9(DATA5)
NetR?#72_1: R?#72.1 U8.7(DATA4)
NetR?#73_1: R?#73.1 U8.6(DATA3)
NetR?#74_1: R?#74.1 U8.5(DATA2)
NetR?#75_1: R?#75.1 U8.4(DATA1)
NetR?#76_1: R?#76.1 U8.3(DATA0)

Not connected (* = marked no-connect by the designer): J1 4(ID)*; U8 12(NC)* 15(SPK_L)* 16(SPK_R)* 17(CPEN)* 25(XO)*

### Buses and harness runs
bus ULPI_D[0..7] = port ULPI_D[0..7]

### Layout directives
differential pair: USB_HS_N, USB_HS_P

### Notes on the sheet
- kiem tra lai USB_VDDIO
- ULPI Output Clock Mode:
  60MHz ULPI clock output. All ULPI signals
  are driven sync
- - Theo datasheet, khi USB3220 là slave thì phải để hở chân ID, VBUS luôn giữ
- kiểm tra xem USB3320 có cần VBUS detect không
- đưa vào CONNECTOR DB9 đường D+ D- VBUS, check lại để hoạt dộng ở slave thì ID là mức 0 hay 1 ( lưu ý là con usb3320 luôn ở slave)
- PC3
- PI11
- PC0
- PA5
- (near R125) 10k for device only
- PB10
- PB11
- PB12
- PB13
- PB5
- (near R134) PA3
- (near R134) PB0
- PB1
- Sub-system:
- Design by:
- Sheet title:
- Project:
- Sheet:
- of
- Checked by:
- Approved by:
- Doc no:
- Revision:
- Size:
- Date:

### Library data of the parts
C29-C37 = CAP_SMD: CAP_Chip; Value: 33pF
FB1 FB2 = CMP-0686-00557-7: Chip Ferrite Bead, 0603, 120Ω @ 100MHz, 0.05Ω, 25%, 2A; Impedance: 120R; Number of Circuits: 1; Shielding: Unshielded; Material: Steel; DC Resistance (DCR): 50mR; Case Code (Imperial): 0603; RoHS Compliant: Yes; Number of Pins: 2; Min Operating Temperature: -55°C; Case Code (Metric): 1608; Frequency: 100MHz; Length: 1.6mm; Test Frequency: 100MHz; Max Operating Temperature: 125°C; Packaging: Tape and Reel; Max Current Rating: 2A; Termination: SMD/SMT; Lead Free: Lead Free; Max DC Current: 2A; Case/Package: 0603; Height: 0.8mm; Current Rating: 2A; Radiation Hardening: No; Core Material: Ferrite; DC Current: 2A; REACH SVHC: No SVHC; Package Quantity: 1; Depth: 0.8mm; Number of Lines: 1; Tolerance: 25%; Width: 0.8mm
J1 = 47590-0001: RightAngle SMT TypeABVersion 2.0 Micro USB Conn Skt,30Vac,1.8A 47650 MICRO-USB | Molex Incorporated 47590-0001; SnapEDA_Link: https://www.snapeda.com/parts/47590-0001/Molex/view-part/?ref=snap; Package: None; Value: *; MF: Molex; MP: 47590-0001; Check_prices: https://www.snapeda.com/parts/47590-0001/Molex/view-part/?ref=eda
R117-R119 = _RES_B_2: RES, 0603
R120 R124 R125 R134-R142 R?#66-R?#76 = _RES_B_2: RES
TVS1 = USBULC6-2F3: TVS DIODE 3VWM 4FLIPCHIP; Manufacturer_Name: STMicroelectronics; Copyright: Copyright (C) 2025 Ultra Librarian. All rights reserved.; Manufacturer_Part_Number: USBULC6-2F3; RefDes: RefDes; Type: Type
U8 = USB3320C-EZK: IC TRANSCEIVER HALF 1/1 32QFN
X3 = NSC5004D-25M: XTAL OSC XO 24.0000MHZ CMOS SMD; Manufacturer_Name: NDK; Manufacturer_Part_Number: NSC5004A-25M; Type: Oscillators; Copyright: Copyright (C) 2025 Ultra Librarian. All rights reserved.; RefDes: RefDes

## Sheet LVDS.SchDoc
size 420 x 297 mm; SheetNumber: 1; SheetTotal: 2
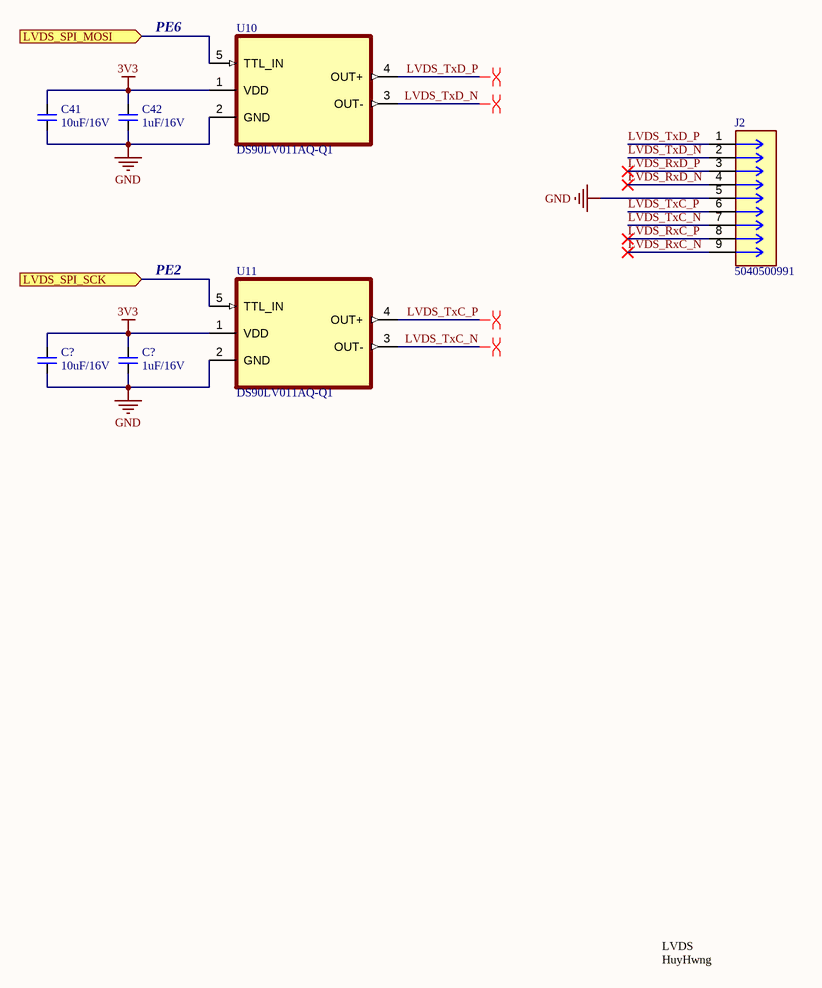
[diagram p9: LVDS.SchDoc]

### Parts
(Parts that share a designator on the sheet are numbered #1, #2 ... from top to bottom, then left to right.)
C41  10uF/16V  [CAP_C_1608X80]
C42  1uF/16V  [CAP_C_1608X80]
C?#10  10uF/16V  [CAP_C_1608X80]
C?#11  1uF/16V  [CAP_C_1608X80]
J2  5040500991  [5040500991]
U10  DS90LV011AQ-Q1  [DS90LV011AQ-Q1]
U11  DS90LV011AQ-Q1  [DS90LV011AQ-Q1]

### Ports
LVDS_SPI_MOSI (in), LVDS_SPI_SCK (in)

### Nets
3V3: C41.2 C42.2 C?#10.2 C?#11.2 U10.1(VDD) U11.1(VDD)
GND: C41.1 C42.1 C?#10.1 C?#11.1 J2.5 U10.2(GND) U11.2(GND)
LVDS_RxC_N: J2.9
LVDS_RxC_P: J2.8
LVDS_RxD_N: J2.4
LVDS_RxD_P: J2.3
LVDS_SPI_MOSI: U10.5(TTL_IN) ; port LVDS_SPI_MOSI
LVDS_SPI_SCK: U11.5(TTL_IN) ; port LVDS_SPI_SCK
LVDS_TxC_N: J2.7 U11.3(OUT-)
LVDS_TxC_P: J2.6 U11.4(OUT+)
LVDS_TxD_N: J2.2 U10.3(OUT-)
LVDS_TxD_P: J2.1 U10.4(OUT+)

### Layout directives
differential pair: LVDS_TxC_N, LVDS_TxC_P, LVDS_TxD_N, LVDS_TxD_P

### Notes on the sheet
- PE6
- PE2
- LVDS
- HuyHwng
- Sub-system:
- Design by:
- Sheet title:
- Project:
- Sheet:
- of
- Checked by:
- Approved by:
- Doc no:
- Revision:
- Size:
- Date:
- (in symbol 5040500991) TAB

### Library data of the parts
C41 C42 C?#10 C?#11 = CAP_SMD: CAP_Chip; Value: 33pF
J2 = 5040500991: Connector Header Surface Mount, Right Angle 9 position 0.059" (1.50mm)
U10 U11 = DS90LV011AQ-Q1: Automotive LVDS Differential Driver

## Sheet MODULE_FPGA.SchDoc
size 420 x 297 mm
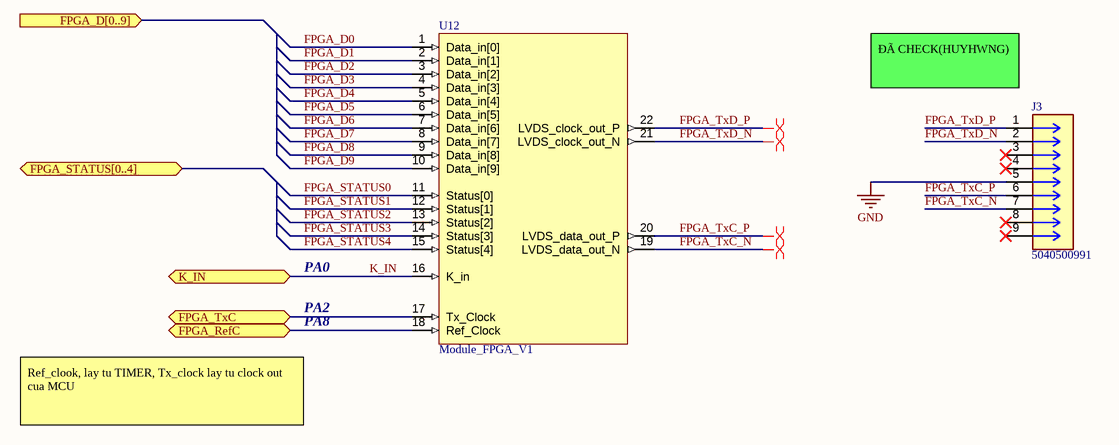
[diagram p10: MODULE_FPGA.SchDoc]

### Parts
J3  5040500991  [5040500991]
U12  Module_FPGA_V1  [MODULE_FPGA]

### Ports
FPGA_D[0..9] (in), FPGA_RefC (bidir), FPGA_STATUS[0..4] (bidir), FPGA_TxC (bidir), K_IN (bidir)

### Nets
GND: J3.5
FPGA_D0: U12.1(Data_in[0])
FPGA_D1: U12.2(Data_in[1])
FPGA_D2: U12.3(Data_in[2])
FPGA_D3: U12.4(Data_in[3])
FPGA_D4: U12.5(Data_in[4])
FPGA_D5: U12.6(Data_in[5])
FPGA_D6: U12.7(Data_in[6])
FPGA_D7: U12.8(Data_in[7])
FPGA_D8: U12.9(Data_in[8])
FPGA_D9: U12.10(Data_in[9])
FPGA_RefC: U12.18(Ref_Clock) ; port FPGA_RefC
FPGA_STATUS0: U12.11(Status[0])
FPGA_STATUS1: U12.12(Status[1])
FPGA_STATUS2: U12.13(Status[2])
FPGA_STATUS3: U12.14(Status[3])
FPGA_STATUS4: U12.15(Status[4])
FPGA_TxC: U12.17(Tx_Clock) ; port FPGA_TxC
FPGA_TxC_N: J3.7 U12.19(LVDS_data_out_N)
FPGA_TxC_P: J3.6 U12.20(LVDS_data_out_P)
FPGA_TxD_N: J3.2 U12.21(LVDS_clock_out_N)
FPGA_TxD_P: J3.1 U12.22(LVDS_clock_out_P)
K_IN: U12.16(K_in) ; port K_IN

Not connected (* = marked no-connect by the designer): J3 3* 4* 8* 9*

### Layout directives
differential pair: FPGA_TxC_N, FPGA_TxC_P, FPGA_TxD_N, FPGA_TxD_P

### Notes on the sheet
- (near J3) ĐÃ CHECK(HUYHWNG)
- PA0
- PA2
- PA8
- Ref_clook, lay tu TIMER, Tx_clock lay tu clock out cua MCU
- Sub-system:
- Design by:
- Sheet title:
- Project:
- Sheet:
- of
- Checked by:
- Approved by:
- Doc no:
- Revision:
- Size:
- Date:
- (in symbol 5040500991) TAB

### Library data of the parts
J3 = 5040500991: as J2 on sheet LVDS

## Sheet DEBUG.SchDoc
size 420 x 297 mm
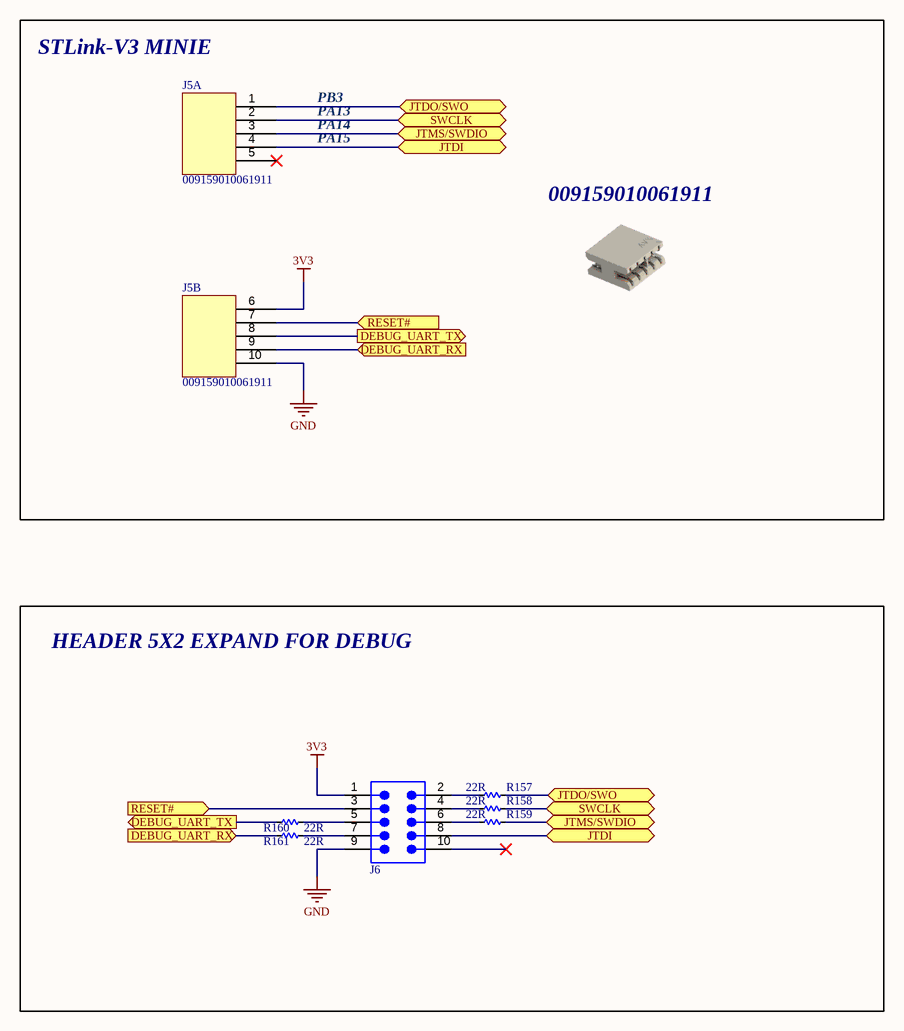
[diagram p11: DEBUG.SchDoc]

### Parts
J5  009159010061911  [009159010061911]  (parts A,B of 2)
J6  61301021121  [61301021121]  (value not drawn)
R157  22R  [RES_C_1608X60]
R158  22R  [RES_C_1608X60]
R159  22R  [RES_C_1608X60]
R160  22R  [RES_C_1608X60]
R161  22R  [RES_C_1608X60]

### Blocks framed on the sheet
HEADER 5X2 EXPAND FOR DEBUG: J6 R157-R161

### Ports
DEBUG_UART_RX (in), DEBUG_UART_TX (out), JTDI (bidir), JTDO/SWO (bidir), JTMS/SWDIO (bidir), RESET# (in), SWCLK (bidir)

### Nets
3V3: J5.6 J6.1
GND: J5.10 J6.9
DEBUG_UART_RX: J5.9 R161.1 ; port DEBUG_UART_RX
DEBUG_UART_TX: J5.8 R160.1 ; port DEBUG_UART_TX
JTCK/SWCLK: J5.2 R158.2 ; port SWCLK
JTDI: J5.4 J6.8 ; port JTDI
JTDO/SWO: J5.1 R157.2 ; port JTDO/SWO
JTMS/SWDIO: J5.3 R159.2 ; port JTMS/SWDIO
RESET#: J5.7 J6.3 ; port RESET#
NetJ6_2: J6.2 R157.1
NetJ6_4: J6.4 R158.1
NetJ6_5: J6.5 R160.2
NetJ6_6: J6.6 R159.1
NetJ6_7: J6.7 R161.2

Not connected (* = marked no-connect by the designer): J5 5*; J6 10*

### Notes on the sheet
- STLink-V3 MINIE
- PB3
- PA13
- PA15
- PA14
- 009159010061911
- Sub-system:
- Design by:
- Sheet title:
- Project:
- Sheet:
- of
- Checked by:
- Approved by:
- Doc no:
- Revision:
- Size:
- Date:

### Library data of the parts
J5 = 009159010061911: pads for STLink V3 minie
J6 = 61301021121: WR-PHD Pin Header, THT, Vertical, pitch 2.54mm, 2 Row, 10P; Manufacturer: Wurth Elektronik; Contact Resistance: 20mOhm; Rated Current: 3A; Working Voltage: 250V; Withstanding Voltage: 500V; Manufacturer Part Number: 61301021121; Category: Board-to-Board Connectors; Match Code: WR-PHD; ComponentLink1Description: Website Link; ComponentLink1URL: https://www.we-online.com/redexpert/article/61301021121?ad; ComponentLink2Description: Datasheet Link; ComponentLink2URL: https://www.we-online.com/redexpert/spec/61301021121?ad; Mount: Through Hole; Operating Temperature Max: 105°C; Operating Temperature Min: -40°C; Packaging: Bag; Gender: Pin Header; Number of Pins: 10; Number of Rows: 2; Orientation: Vertical; Pitch: 2.54mm
R157-R161 = _RES_B_2: RES